# EAGLE schematic Printplaat version 2 with booting problems (EAGLE 9.7.0)

## Sheet 1 of 7: Raspberry Pi CM4 header
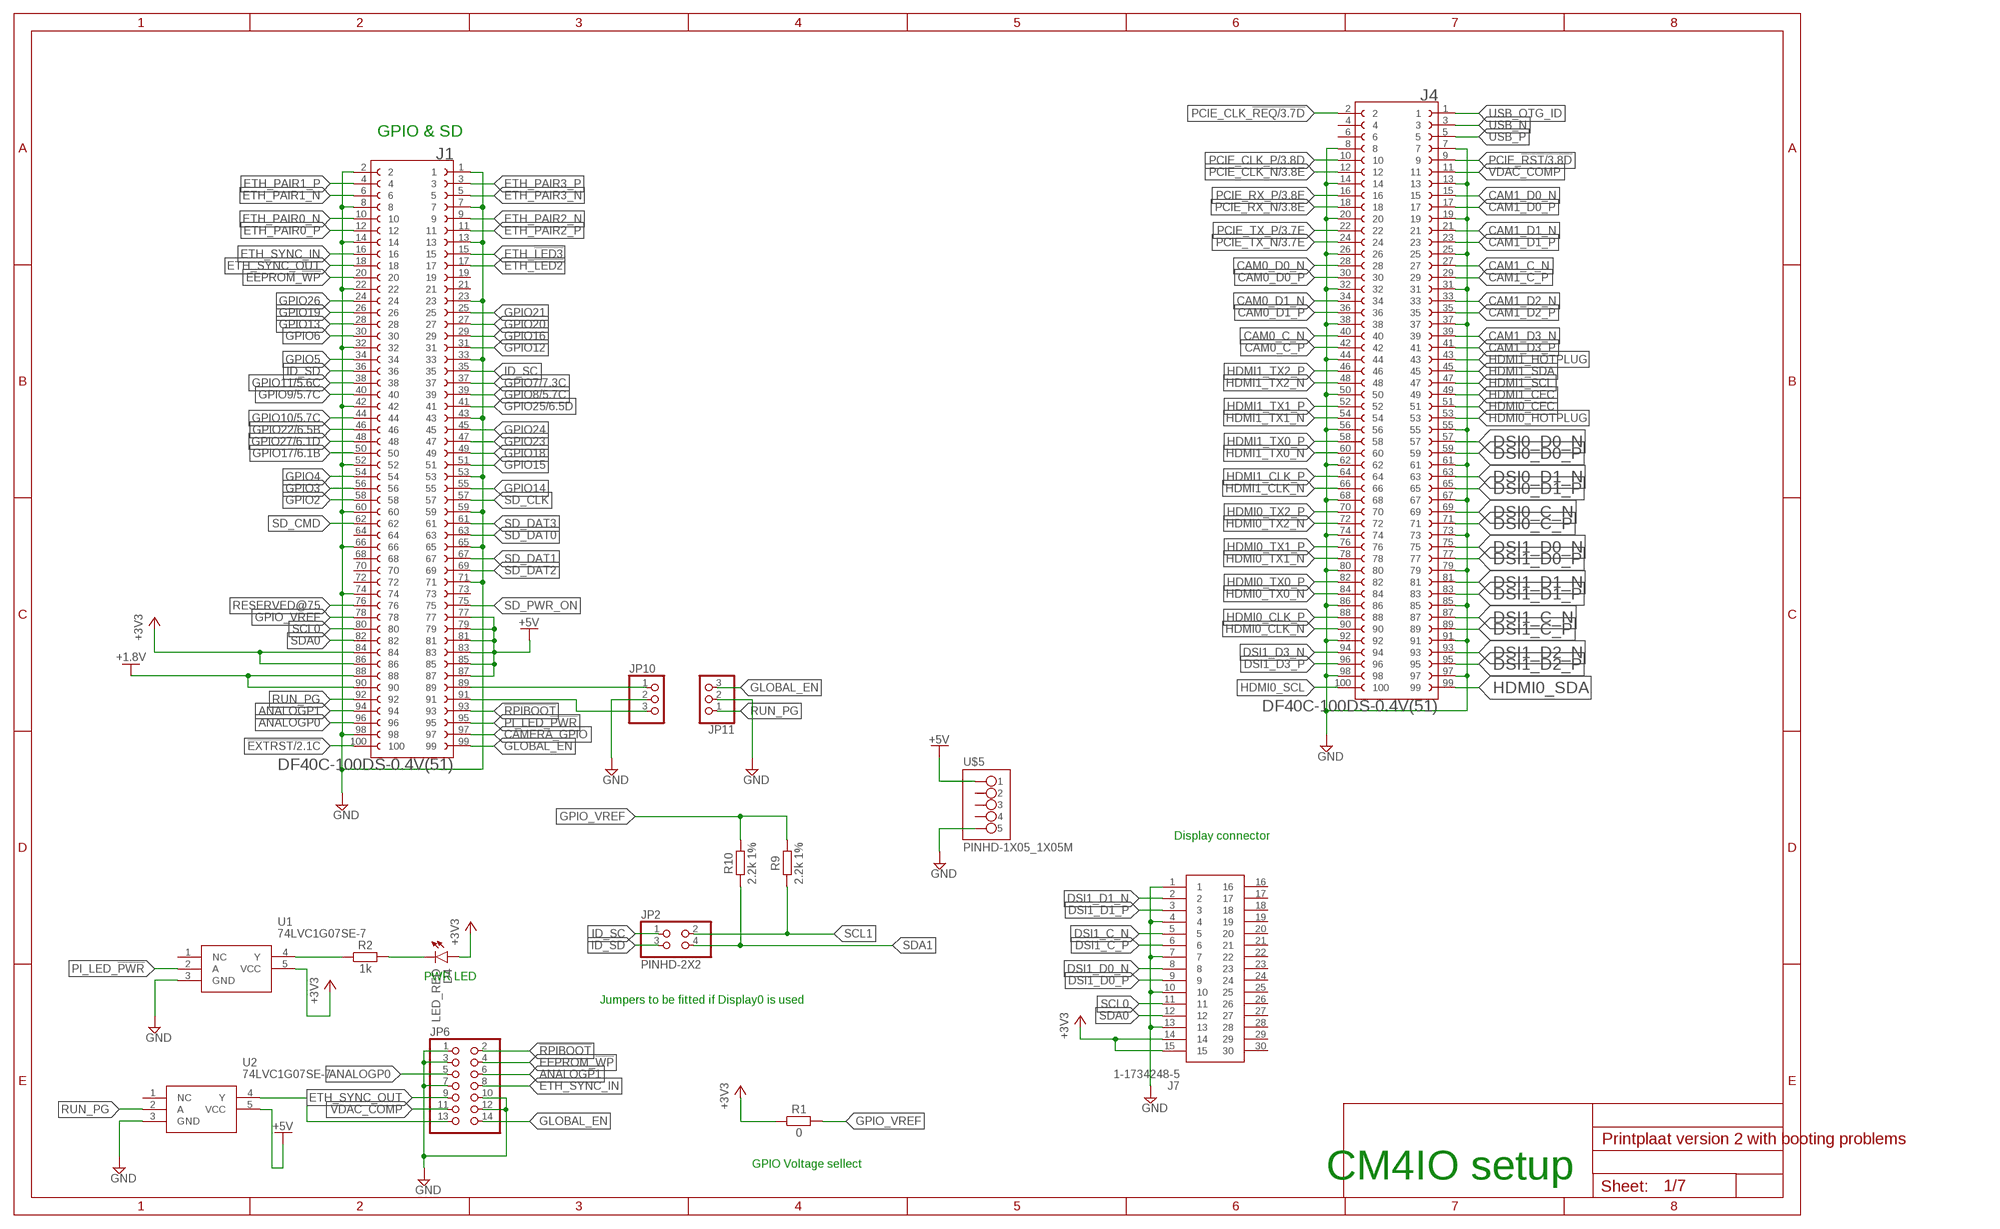
[diagram p0: schematic, sheet 1]

### Parts
D4  LED_RED  CHIP-FLAT-R_1206  [LEDC3216X75N_FLAT-R]
J1  DF40C-100DS-0.4V(51)  [HIROSE_DF40C-100DS-0.4V(51)]
J4  DF40C-100DS-0.4V(51)  [HIROSE_DF40C-100DS-0.4V(51)]
J7  1-1734248-5  [117342485]
JP2  PINHD-2X2  [2X02]
JP6  PINHD-2X7  [2X07]
JP10  PINHD-1X3  [1X03]
JP11  PINHD-1X3  [1X03]
R1  0  RESISTOR__CHIP-1206(3216-METRIC)  [RESC3216X70]
R2  1k  RESISTOR__CHIP-1206(3216-METRIC)  [RESC3216X70]
R9  2.2k 1%  RESISTOR__CHIP-1206(3216-METRIC)  [RESC3216X70]
R10  2.2k 1%  RESISTOR__CHIP-1206(3216-METRIC)  [RESC3216X70]
U1  74LVC1G07SE-7  [SOT65P210X110-5N]
U2  74LVC1G07SE-7  [SOT65P210X110-5N]
U$5  PINHD-1X05_1X05M  [1X05]

### Nets
!EXTRST: J1.100 ; also sheet 2
!RPIBOOT: J1.93 JP6.2
+1.8V: J1.88 J1.90
+3V3: D4.A J1.84 J1.86 J7.14 J7.15 R1.1 U1.5(VCC) ; also sheet 2,3
+5V: J1.77 J1.79 J1.81 J1.83 J1.85 J1.87 U2.5(VCC) U$5.1 ; also sheet 2,3,4,5,6,7
ANALOGP0: J1.96 JP6.5
ANALOGP1: J1.94 JP6.6
CAM0_C_N: J4.40
CAM0_C_P: J4.42
CAM0_D0_N: J4.28
CAM0_D0_P: J4.30
CAM0_D1_N: J4.34
CAM0_D1_P: J4.36
CAM1_C_N: J4.27
CAM1_C_P: J4.29
CAM1_D0_N: J4.15
CAM1_D0_P: J4.17
CAM1_D1_N: J4.21
CAM1_D1_P: J4.23
CAM1_D2_N: J4.33
CAM1_D2_P: J4.35
CAM1_D3_N: J4.39
CAM1_D3_P: J4.41
CAMERA_GPIO: J1.97
DSI0_C_N: J4.69
DSI0_C_P: J4.71
DSI0_D0_N: J4.57
DSI0_D0_P: J4.59
DSI0_D1_N: J4.63
DSI0_D1_P: J4.65
DSI1_C_N: J4.87 J7.5
DSI1_C_P: J4.89 J7.6
DSI1_D0_N: J4.75 J7.8
DSI1_D0_P: J4.77 J7.9
DSI1_D1_N: J4.81 J7.2
DSI1_D1_P: J4.83 J7.3
DSI1_D2_N: J4.93
DSI1_D2_P: J4.95
DSI1_D3_N: J4.94
DSI1_D3_P: J4.96
EEPROM_!WP: J1.20 JP6.4
ETH_!LED2: J1.17
ETH_!LED3: J1.15
ETH_PAIR0_N: J1.10
ETH_PAIR0_P: J1.12
ETH_PAIR1_N: J1.6
ETH_PAIR1_P: J1.4
ETH_PAIR2_N: J1.9
ETH_PAIR2_P: J1.11
ETH_PAIR3_N: J1.5
ETH_PAIR3_P: J1.3
ETH_SYNC_IN: J1.16 JP6.8
ETH_SYNC_OUT: J1.18 JP6.9
GLOBAL_EN: J1.99 JP6.14 JP11.3
GND: J1.1 J1.2 J1.7 J1.8 J1.13 J1.14 J1.22 J1.23 J1.32 J1.33 J1.42 J1.43 J1.52 J1.53 J1.59 J1.60 J1.65 J1.66 J1.71 J1.74 J1.98 J4.7 J4.8 J4.13 J4.14 J4.19 J4.20 J4.25 J4.26 J4.31 J4.32 J4.37 J4.38 J4.44 J4.50 J4.55 J4.56 J4.61 J4.62 J4.67 J4.68 J4.73 J4.74 J4.79 J4.80 J4.85 J4.86 J4.91 J4.92 J4.97 J4.98 J7.1 J7.4 J7.7 J7.10 J7.13 JP6.1 JP6.3 JP6.7 JP6.10 JP6.12 JP10.2 JP11.2 U1.3(GND) U2.3(GND) U$5.5 ; also sheet 2,3,4,5,6,7
GPIO2: J1.58
GPIO3: J1.56
GPIO4: J1.54
GPIO5: J1.34
GPIO6: J1.30
GPIO7: J1.37 ; also sheet 7
GPIO8: J1.39 ; also sheet 5
GPIO9: J1.40 ; also sheet 5
GPIO10: J1.44 ; also sheet 5,7
GPIO11: J1.38 ; also sheet 5,7
GPIO12: J1.31
GPIO13: J1.28
GPIO14: J1.55
GPIO15: J1.51
GPIO16: J1.29
GPIO17: J1.50 ; also sheet 6
GPIO18: J1.49
GPIO19: J1.26
GPIO20: J1.27
GPIO21: J1.25
GPIO22: J1.46 ; also sheet 6
GPIO23: J1.47
GPIO24: J1.45
GPIO25: J1.41 ; also sheet 6
GPIO26: J1.24
GPIO27: J1.48 ; also sheet 6
GPIO_VREF: J1.78 R1.2 R9.2 R10.2
HDMI0_CEC: J4.51
HDMI0_CLK_N: J4.90
HDMI0_CLK_P: J4.88
HDMI0_HOTPLUG: J4.53
HDMI0_SCL: J4.100
HDMI0_SDA: J4.99
HDMI0_TX0_N: J4.84
HDMI0_TX0_P: J4.82
HDMI0_TX1_N: J4.78
HDMI0_TX1_P: J4.76
HDMI0_TX2_N: J4.72
HDMI0_TX2_P: J4.70
HDMI1_CEC: J4.49
HDMI1_CLK_N: J4.66
HDMI1_CLK_P: J4.64
HDMI1_HOTPLUG: J4.43
HDMI1_SCL: J4.47
HDMI1_SDA: J4.45
HDMI1_TX0_N: J4.60
HDMI1_TX0_P: J4.58
HDMI1_TX1_N: J4.54
HDMI1_TX1_P: J4.52
HDMI1_TX2_N: J4.48
HDMI1_TX2_P: J4.46
ID_SC: J1.35 JP2.1
ID_SD: J1.36 JP2.3
N$3: R2.1 U1.4(Y)
N$4: D4.C R2.2
N$5: JP6.13 U2.4(Y)
N$54: J1.89 JP10.1
N$55: J1.91 JP10.3
PCIE_!RST: J4.9 ; also sheet 3
PCIE_CLK_!REQ: J4.2 ; also sheet 3
PCIE_CLK_N: J4.12 ; also sheet 3
PCIE_CLK_P: J4.10 ; also sheet 3
PCIE_RX_N: J4.18 ; also sheet 3
PCIE_RX_P: J4.16 ; also sheet 3
PCIE_TX_N: J4.24 ; also sheet 3
PCIE_TX_P: J4.22 ; also sheet 3
PI_LED_!PWR: J1.95 U1.2(A)
RESERVED@75: J1.76
RUN_PG: J1.92 JP11.1 U2.2(A)
SCL0: J1.80 J7.11
SCL1: JP2.2 R9.1
SD_CLK: J1.57
SD_CMD: J1.62
SD_DAT0: J1.63
SD_DAT1: J1.67
SD_DAT2: J1.69
SD_DAT3: J1.61
SD_PWR_ON: J1.75
SDA0: J1.82 J7.12
SDA1: JP2.4 R10.1
USB_N: J4.3
USB_OTG_ID: J4.1
USB_P: J4.5
VDAC_COMP: J4.11 JP6.11
Unconnected: J1.19 J1.21 J1.64 J1.68 J1.70 J1.72 J1.73 J4.4 J4.6 J7.16 J7.17 J7.18 J7.19 J7.20 J7.21 J7.22 J7.23 J7.24 J7.25 J7.26 J7.27 J7.28 J7.29 J7.30 U1.1(NC) U2.1(NC) U$5.2 U$5.3 U$5.4

### Notes on the sheet
- GPIO & SD
- Display connector
- PWR LED
- Jumpers to be fitted if Display0 is used
- GPIO Voltage sellect
- CM4IO setup

## Sheet 2 of 7: USB & ESD protection
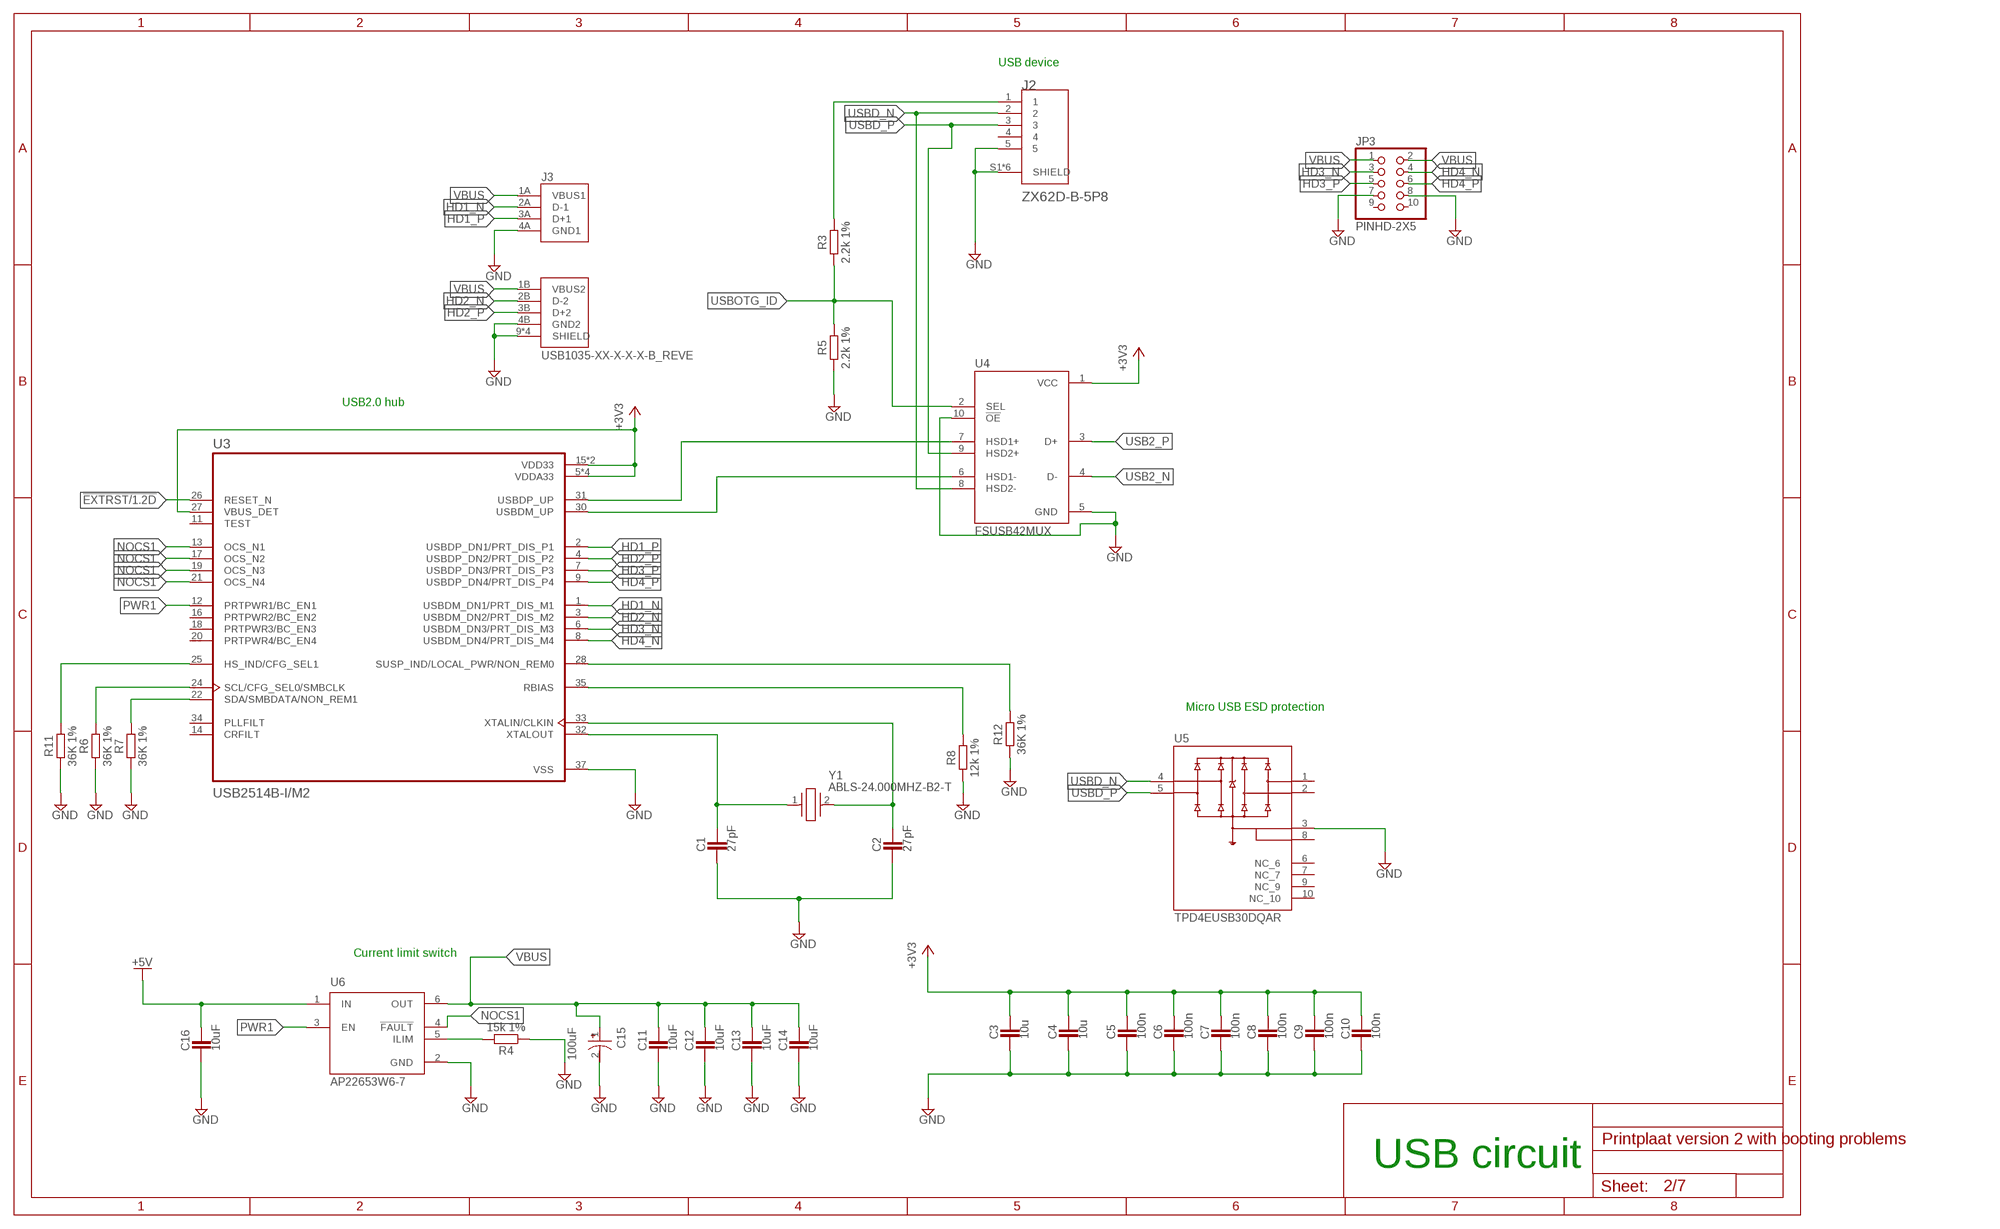
[diagram p1: schematic, sheet 2]

### Parts
C1  27pF  CAPACITOR_CHIP-1206(3216-METRIC)  [CAPC3216X135]
C2  27pF  CAPACITOR_CHIP-1206(3216-METRIC)  [CAPC3216X135]
C3  10u  CAPACITOR_CHIP-1206(3216-METRIC)  [CAPC3216X135]
C4  10u  CAPACITOR_CHIP-1206(3216-METRIC)  [CAPC3216X135]
C5  100n  CAPACITOR_CHIP-1206(3216-METRIC)  [CAPC3216X135]
C6  100n  CAPACITOR_CHIP-1206(3216-METRIC)  [CAPC3216X135]
C7  100n  CAPACITOR_CHIP-1206(3216-METRIC)  [CAPC3216X135]
C8  100n  CAPACITOR_CHIP-1206(3216-METRIC)  [CAPC3216X135]
C9  100n  CAPACITOR_CHIP-1206(3216-METRIC)  [CAPC3216X135]
C10  100n  CAPACITOR_CHIP-1206(3216-METRIC)  [CAPC3216X135]
C11  10uF  CAPACITOR_CHIP-1206(3216-METRIC)  [CAPC3216X135]
C12  10uF  CAPACITOR_CHIP-1206(3216-METRIC)  [CAPC3216X135]
C13  10uF  CAPACITOR_CHIP-1206(3216-METRIC)  [CAPC3216X135]
C14  10uF  CAPACITOR_CHIP-1206(3216-METRIC)  [CAPC3216X135]
C15  100uF  20TDC100MYF  [CAP_20TDC100MYF]
C16  10uF  CAPACITOR_CHIP-1206(3216-METRIC)  [CAPC3216X135]
J2  ZX62D-B-5P8  [HRS_ZX62D-B-5P8]
J3  USB1035-XX-X-X-X-B_REVE  [GCT_USB1035-XX-X-X-X-B_REVE]
JP3  PINHD-2X5  [2X05]
R3  2.2k 1%  RESISTOR__CHIP-1206(3216-METRIC)  [RESC3216X70]
R4  15k 1%  RESISTOR__CHIP-1206(3216-METRIC)  [RESC3216X70]
R5  2.2k 1%  RESISTOR__CHIP-1206(3216-METRIC)  [RESC3216X70]
R6  36K 1%  RESISTOR__CHIP-1206(3216-METRIC)  [RESC3216X70]
R7  36K 1%  RESISTOR__CHIP-1206(3216-METRIC)  [RESC3216X70]
R8  12k 1%  RESISTOR__CHIP-1206(3216-METRIC)  [RESC3216X70]
R11  36K 1%  RESISTOR__CHIP-1206(3216-METRIC)  [RESC3216X70]
R12  36K 1%  RESISTOR__CHIP-1206(3216-METRIC)  [RESC3216X70]
U3  USB2514B-I/M2  [QFN50P600X600X100-37N]
U4  FSUSB42MUX  [SOP50P490X110-10N]
U5  TPD4EUSB30DQAR  [IC_TPD4EUSB30DQAR]
U6  AP22653W6-7  [SOT95P280X145-6N]
Y1  ABLS-24.000MHZ-B2-T  [ABLS]

### Nets
!EXTRST: U3.26(RESET_N) ; also sheet 1
+3V3: C3.1 C4.1 C5.1 C6.1 C7.1 C8.1 C9.1 C10.1 U3.5(VDDA33) U3.10(VDDA33) U3.15(VDD33) U3.23(VDD33) U3.27(VBUS_DET) U3.29(VDDA33) U3.36(VDDA33) U4.1(VCC) ; also sheet 1,3
+5V: C16.1 U6.1(IN) ; also sheet 1,3,4,5,6,7
GND: C1.2 C2.2 C3.2 C4.2 C5.2 C6.2 C7.2 C8.2 C9.2 C10.2 C11.2 C12.2 C13.2 C14.2 C15.2 C16.2 J2.5 J2.S1(SHIELD) J2.S2(SHIELD) J2.S3(SHIELD) J2.S4(SHIELD) J2.S5(SHIELD) J2.S6(SHIELD) J3.4A(GND1) J3.4B(GND2) J3.9(SHIELD) J3.10(SHIELD) J3.11(SHIELD) J3.12(SHIELD) JP3.7 JP3.8 R4.1 R5.1 R6.1 R7.1 R8.1 R11.1 R12.1 U3.37(VSS) U4.5(GND) U4.10(!OE) U5.3(GND_3) U6.2(GND) ; also sheet 1,3,4,5,6,7
HD1_N: J3.2A(D-1) U3.1(USBDM_DN1/PRT_DIS_M1)
HD1_P: J3.3A(D+1) U3.2(USBDP_DN1/PRT_DIS_P1)
HD2_N: J3.2B(D-2) U3.3(USBDM_DN2/PRT_DIS_M2)
HD2_P: J3.3B(D+2) U3.4(USBDP_DN2/PRT_DIS_P2)
HD3_N: JP3.3 U3.6(USBDM_DN3/PRT_DIS_M3)
HD3_P: JP3.5 U3.7(USBDP_DN3/PRT_DIS_P3)
HD4_N: JP3.4 U3.8(USBDM_DN4/PRT_DIS_M4)
HD4_P: JP3.6 U3.9(USBDP_DN4/PRT_DIS_P4)
N$6: R7.2 U3.22(SDA/SMBDATA/NON_REM1)
N$7: R6.2 U3.24(SCL/CFG_SEL0/SMBCLK)
N$8: R11.2 U3.25(HS_IND/CFG_SEL1)
N$9: R12.2 U3.28(SUSP_IND/LOCAL_PWR/NON_REM0)
N$10: R8.2 U3.35(RBIAS)
N$11: C2.1 U3.33(XTALIN/CLKIN) Y1.2
N$12: C1.1 U3.32(XTALOUT) Y1.1
N$13: U3.31(USBDP_UP) U4.7(HSD1+)
N$14: U3.30(USBDM_UP) U4.6(HSD1-)
N$17: J2.1 R3.2
N$18: R4.2 U6.5(ILIM)
NOCS1: U3.13(OCS_N1) U3.17(OCS_N2) U3.19(OCS_N3) U3.21(OCS_N4) U6.4(!FAULT)
PWR1: U3.12(PRTPWR1/BC_EN1) U6.3(EN)
USB2_N: U4.4(D-)
USB2_P: U4.3(D+)
USBD_N: J2.2 U4.8(HSD2-) U5.4(D2+)
USBD_P: J2.3 U4.9(HSD2+) U5.5(D2-)
USBOTG_ID: R3.1 R5.2 U4.2(SEL)
VBUS: C11.1 C12.1 C13.1 C14.1 C15.1 J3.1A(VBUS1) J3.1B(VBUS2) JP3.1 JP3.2 U6.6(OUT)
Unconnected: J2.4 JP3.9 JP3.10 U3.11(TEST) U3.14(CRFILT) U3.16(PRTPWR2/BC_EN2) U3.18(PRTPWR3/BC_EN3) U3.20(PRTPWR4/BC_EN4) U3.34(PLLFILT) U5.1(D1+) U5.2(D1-) U5.6(NC_6) U5.7(NC_7) U5.9(NC_9) U5.10(NC_10)

### Notes on the sheet
- USB device
- USB2.0 hub
- Micro USB ESD protection
- Current limit switch
- USB circuit

## Sheet 3 of 7: PCIe connector and 12V Boost Converter
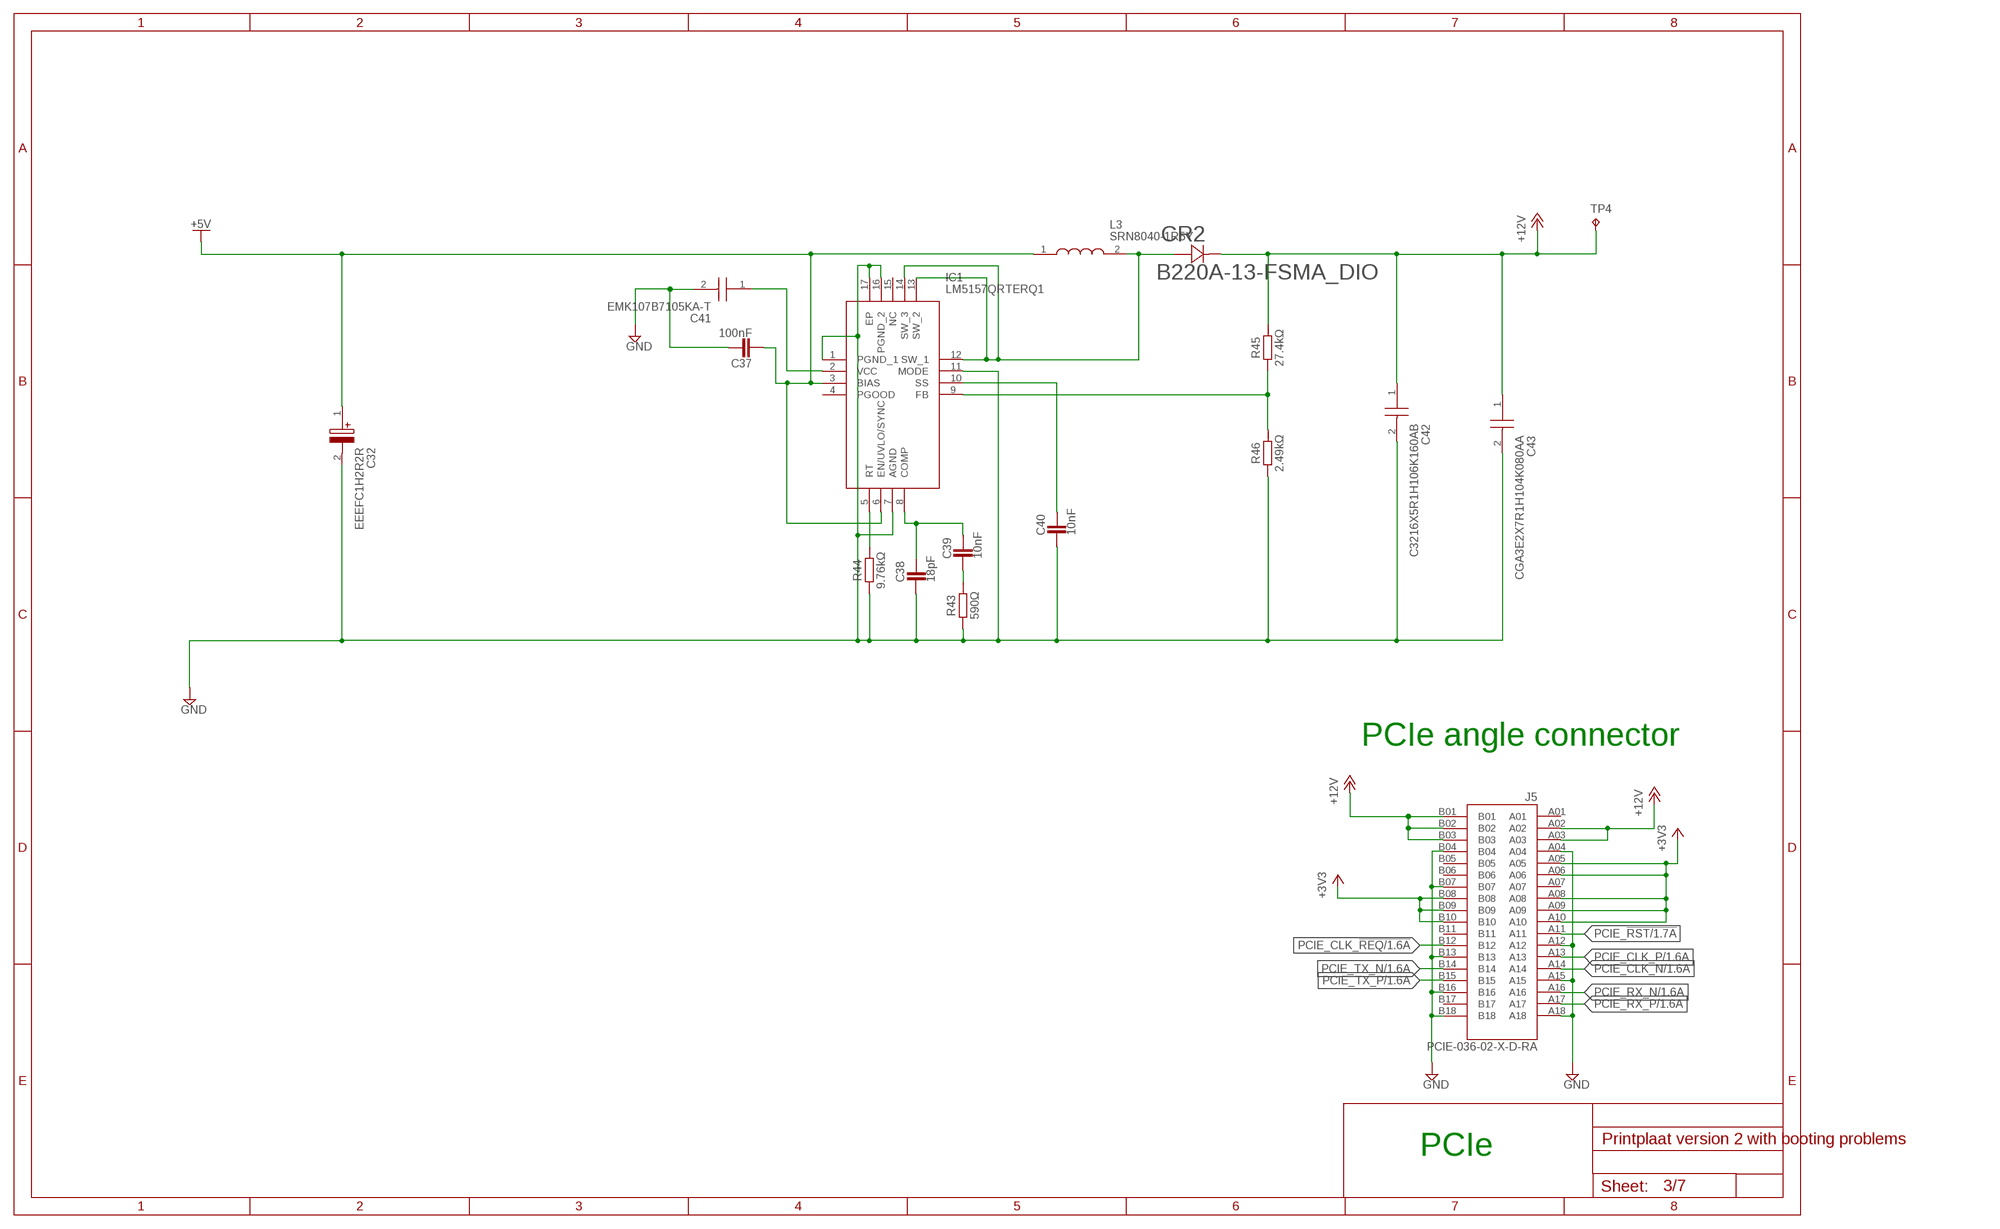
[diagram p2: schematic, sheet 3]

### Parts
C32  EEEFC1H2R2R  [EEE1AA220WR]
C37  100nF  CAPACITOR_CHIP-1206(3216-METRIC)  [CAPC3216X135]
C38  18pF  CAPACITOR_CHIP-1206(3216-METRIC)  [CAPC3216X135]
C39  10nF  CAPACITOR_CHIP-1206(3216-METRIC)  [CAPC3216X135]
C40  10nF  CAPACITOR_CHIP-1206(3216-METRIC)  [CAPC3216X135]
C41  EMK107B7105KA-T  [CAPC1608X90N]
C42  C3216X5R1H106K160AB  [CAPC3216X180N]
C43  CGA3E2X7R1H104K080AA  [CAPC1608X90N]
CR2  B220A-13-FSMA_DIO  [SMA_DIO]
IC1  LM5157QRTERQ1  [QFN50P300X300X80-17N]
J5  PCIE-036-02-X-D-RA  [SAMTEC_PCIE-036-02-X-D-RA]
L3  SRN8040-1R5Y  [SRN80408R2Y]
R43  590Ω  RESISTOR__CHIP-1206(3216-METRIC)  [RESC3216X70]
R44  9.76kΩ  RESISTOR__CHIP-1206(3216-METRIC)  [RESC3216X70]
R45  27.4kΩ  RESISTOR__CHIP-1206(3216-METRIC)  [RESC3216X70]
R46  2.49kΩ  RESISTOR__CHIP-1206(3216-METRIC)  [RESC3216X70]
TP4  TPB1,27  [B1,27]

### Nets
+3V3: J5.A05 J5.A06 J5.A08 J5.A09 J5.A10 J5.B08 J5.B09 J5.B10 ; also sheet 1,2
+5V: C32.1(+) C37.2 IC1.3(BIAS) IC1.6(EN/UVLO/SYNC) L3.1 ; also sheet 1,2,4,5,6,7
+12V: C42.1 C43.1 CR2.1 J5.A02 J5.A03 J5.B01 J5.B02 J5.B03 R45.2 TP4.TP
GND: C32.2(-) C37.1 C38.2 C40.2 C41.2 C42.2 C43.2 IC1.1(PGND_1) IC1.7(AGND) IC1.11(MODE) IC1.16(PGND_2) IC1.17(EP) J5.A04 J5.A12 J5.A15 J5.A18 J5.B04 J5.B07 J5.B13 J5.B16 J5.B18 R43.1 R44.1 R46.1 ; also sheet 1,2,4,5,6,7
N$57: C41.1 IC1.2(VCC)
N$58: C38.1 C39.1 IC1.8(COMP)
N$59: C39.2 R43.2
N$60: C40.1 IC1.10(SS)
N$61: IC1.5(RT) R44.2
N$62: CR2.2 IC1.12(SW_1) IC1.13(SW_2) IC1.14(SW_3) L3.2
N$63: IC1.9(FB) R45.1 R46.2
PCIE_!RST: J5.A11 ; also sheet 1
PCIE_CLK_!REQ: J5.B12 ; also sheet 1
PCIE_CLK_N: J5.A14 ; also sheet 1
PCIE_CLK_P: J5.A13 ; also sheet 1
PCIE_RX_N: J5.A16 ; also sheet 1
PCIE_RX_P: J5.A17 ; also sheet 1
PCIE_TX_N: J5.B14 ; also sheet 1
PCIE_TX_P: J5.B15 ; also sheet 1
Unconnected: IC1.4(PGOOD) IC1.15(NC) J5.A01 J5.A07 J5.B05 J5.B06 J5.B11 J5.B17

### Notes on the sheet
- PCIe angle connector
- PCIe

## Sheet 4 of 7: Buck & Boost converter
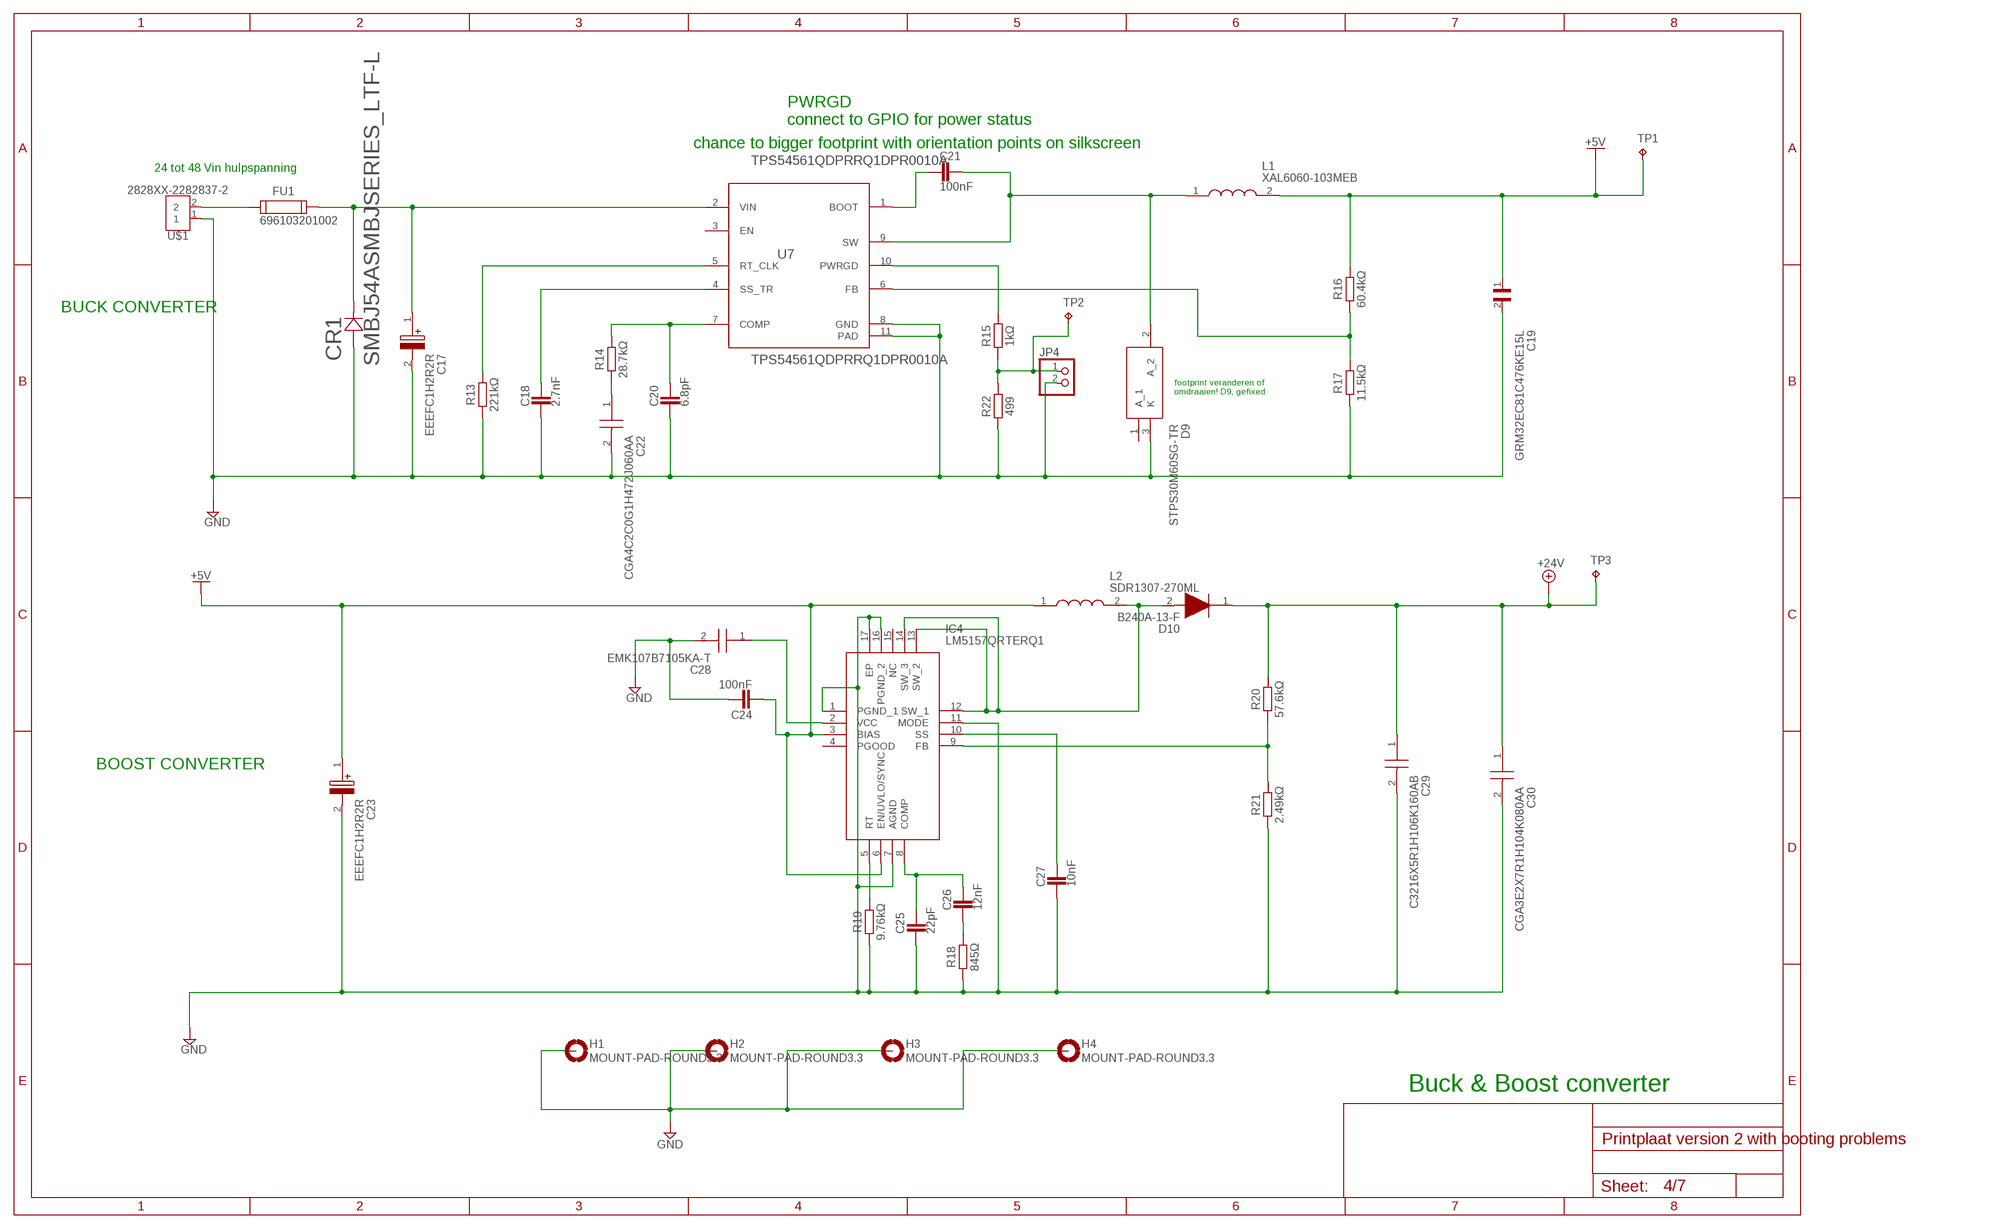
[diagram p3: schematic, sheet 4]

### Parts
C17  EEEFC1H2R2R  [EEE1AA220WR]
C18  2.7nF  CAPACITOR_CHIP-1206(3216-METRIC)  [CAPC3216X135]
C19  GRM32EC81C476KE15L  [CAPC3225X270N]
C20  6.8pF  CAPACITOR_CHIP-1206(3216-METRIC)  [CAPC3216X135]
C21  100nF  CAPACITOR_CHIP-1206(3216-METRIC)  [CAPC3216X135]
C22  CGA4C2C0G1H472J060AA  [CAPC2012X75N]
C23  EEEFC1H2R2R  [EEE1AA220WR]
C24  100nF  CAPACITOR_CHIP-1206(3216-METRIC)  [CAPC3216X135]
C25  22pF  CAPACITOR_CHIP-1206(3216-METRIC)  [CAPC3216X135]
C26  12nF  CAPACITOR_CHIP-1206(3216-METRIC)  [CAPC3216X135]
C27  10nF  CAPACITOR_CHIP-1206(3216-METRIC)  [CAPC3216X135]
C28  EMK107B7105KA-T  [CAPC1608X90N]
C29  C3216X5R1H106K160AB  [CAPC3216X180N]
C30  CGA3E2X7R1H104K080AA  [CAPC1608X90N]
CR1  SMBJ54ASMBJSERIES_LTF-L  [SMBJSERIES_LTF-L]
D9  STPS30M60SG-TR  [T1210T8G]
D10  B240A-13-F  [DIOM5226X230N]
FU1  696103201002  [696103201002]
H1  MOUNT-PAD-ROUND3.3  [3,3-PAD]
H2  MOUNT-PAD-ROUND3.3  [3,3-PAD]
H3  MOUNT-PAD-ROUND3.3  [3,3-PAD]
H4  MOUNT-PAD-ROUND3.3  [3,3-PAD]
IC4  LM5157QRTERQ1  [QFN50P300X300X80-17N]
JP4  PINHD-1X2  [1X02]
L1  XAL6060-103MEB  [XAL6060-103MEB]
L2  SDR1307-270ML  [SDR1307270ML]
R13  221kΩ  RESISTOR__CHIP-1206(3216-METRIC)  [RESC3216X70]
R14  28.7kΩ  RESISTOR__CHIP-1206(3216-METRIC)  [RESC3216X70]
R15  1kΩ  RESISTOR__CHIP-1206(3216-METRIC)  [RESC3216X70]
R16  60.4kΩ  RESISTOR__CHIP-1206(3216-METRIC)  [RESC3216X70]
R17  11.5kΩ  RESISTOR__CHIP-1206(3216-METRIC)  [RESC3216X70]
R18  845Ω  RESISTOR__CHIP-1206(3216-METRIC)  [RESC3216X70]
R19  9.76kΩ  RESISTOR__CHIP-1206(3216-METRIC)  [RESC3216X70]
R20  57.6kΩ  RESISTOR__CHIP-1206(3216-METRIC)  [RESC3216X70]
R21  2.49kΩ  RESISTOR__CHIP-1206(3216-METRIC)  [RESC3216X70]
R22  499  RESISTOR__CHIP-1206(3216-METRIC)  [RESC3216X70]
TP1  TPB1,27  [B1,27]
TP2  TPB1,27  [B1,27]
TP3  TPB1,27  [B1,27]
U7  TPS54561QDPRRQ1DPR0010A  [DPR0010A]
U$1  2828XX-2282837-2  [TERMBLK_508-2N]

### Nets
+5V: C19.1 C23.1(+) C24.2 IC4.3(BIAS) IC4.6(EN/UVLO/SYNC) L1.2 L2.1 R16.2 TP1.TP ; also sheet 1,2,3,5,6,7
+24V: C29.1 C30.1 D10.1(K) R20.2 TP3.TP ; also sheet 5,6,7
GND: C17.2(-) C18.2 C19.2 C20.2 C22.2 C23.2(-) C24.1 C25.2 C27.2 C28.2 C29.2 C30.2 CR1.2 D9.3(K) H1.B3,3(MOUNT) H2.B3,3(MOUNT) H3.B3,3(MOUNT) H4.B3,3(MOUNT) IC4.1(PGND_1) IC4.7(AGND) IC4.11(MODE) IC4.16(PGND_2) IC4.17(EP) JP4.2 R13.1 R17.1 R18.1 R19.1 R21.1 R22.1 U7.8(GND) U7.11(PAD) U$1.1 ; also sheet 1,2,3,5,6,7
N$22: C17.1(+) CR1.1 FU1.2 U7.2(VIN)
N$23: R13.2 U7.5(RT_CLK)
N$24: C18.1 U7.4(SS_TR)
N$25: C22.1 R14.1
N$26: C20.1 R14.2 U7.7(COMP)
N$27: C21.2 U7.1(BOOT)
N$28: C21.1 D9.2(A_2) L1.1 U7.9(SW)
N$29: R15.2 U7.10(PWRGD)
N$30: R16.1 R17.2 U7.6(FB)
N$31: C28.1 IC4.2(VCC)
N$32: C25.1 C26.1 IC4.8(COMP)
N$33: C26.2 R18.2
N$34: C27.1 IC4.10(SS)
N$35: IC4.5(RT) R19.2
N$36: D10.2(A) IC4.12(SW_1) IC4.13(SW_2) IC4.14(SW_3) L2.2
N$37: IC4.9(FB) R20.1 R21.2
N$38: JP4.1 R15.1 R22.2 TP2.TP
N$53: FU1.1 U$1.2
Unconnected: D9.1(A_1) IC4.4(PGOOD) IC4.15(NC) U7.3(EN)

### Notes on the sheet
- PWRGD 
  connect to GPIO for power status
- chance to bigger footprint with orientation points on silkscreen
- 24 tot 48 Vin hulpspanning
- BUCK CONVERTER
- footprint veranderen of
  omdraaien! D9, gefixed
- BOOST CONVERTER
- Buck & Boost converter

## Sheet 5 of 7: Current sensor and ADC
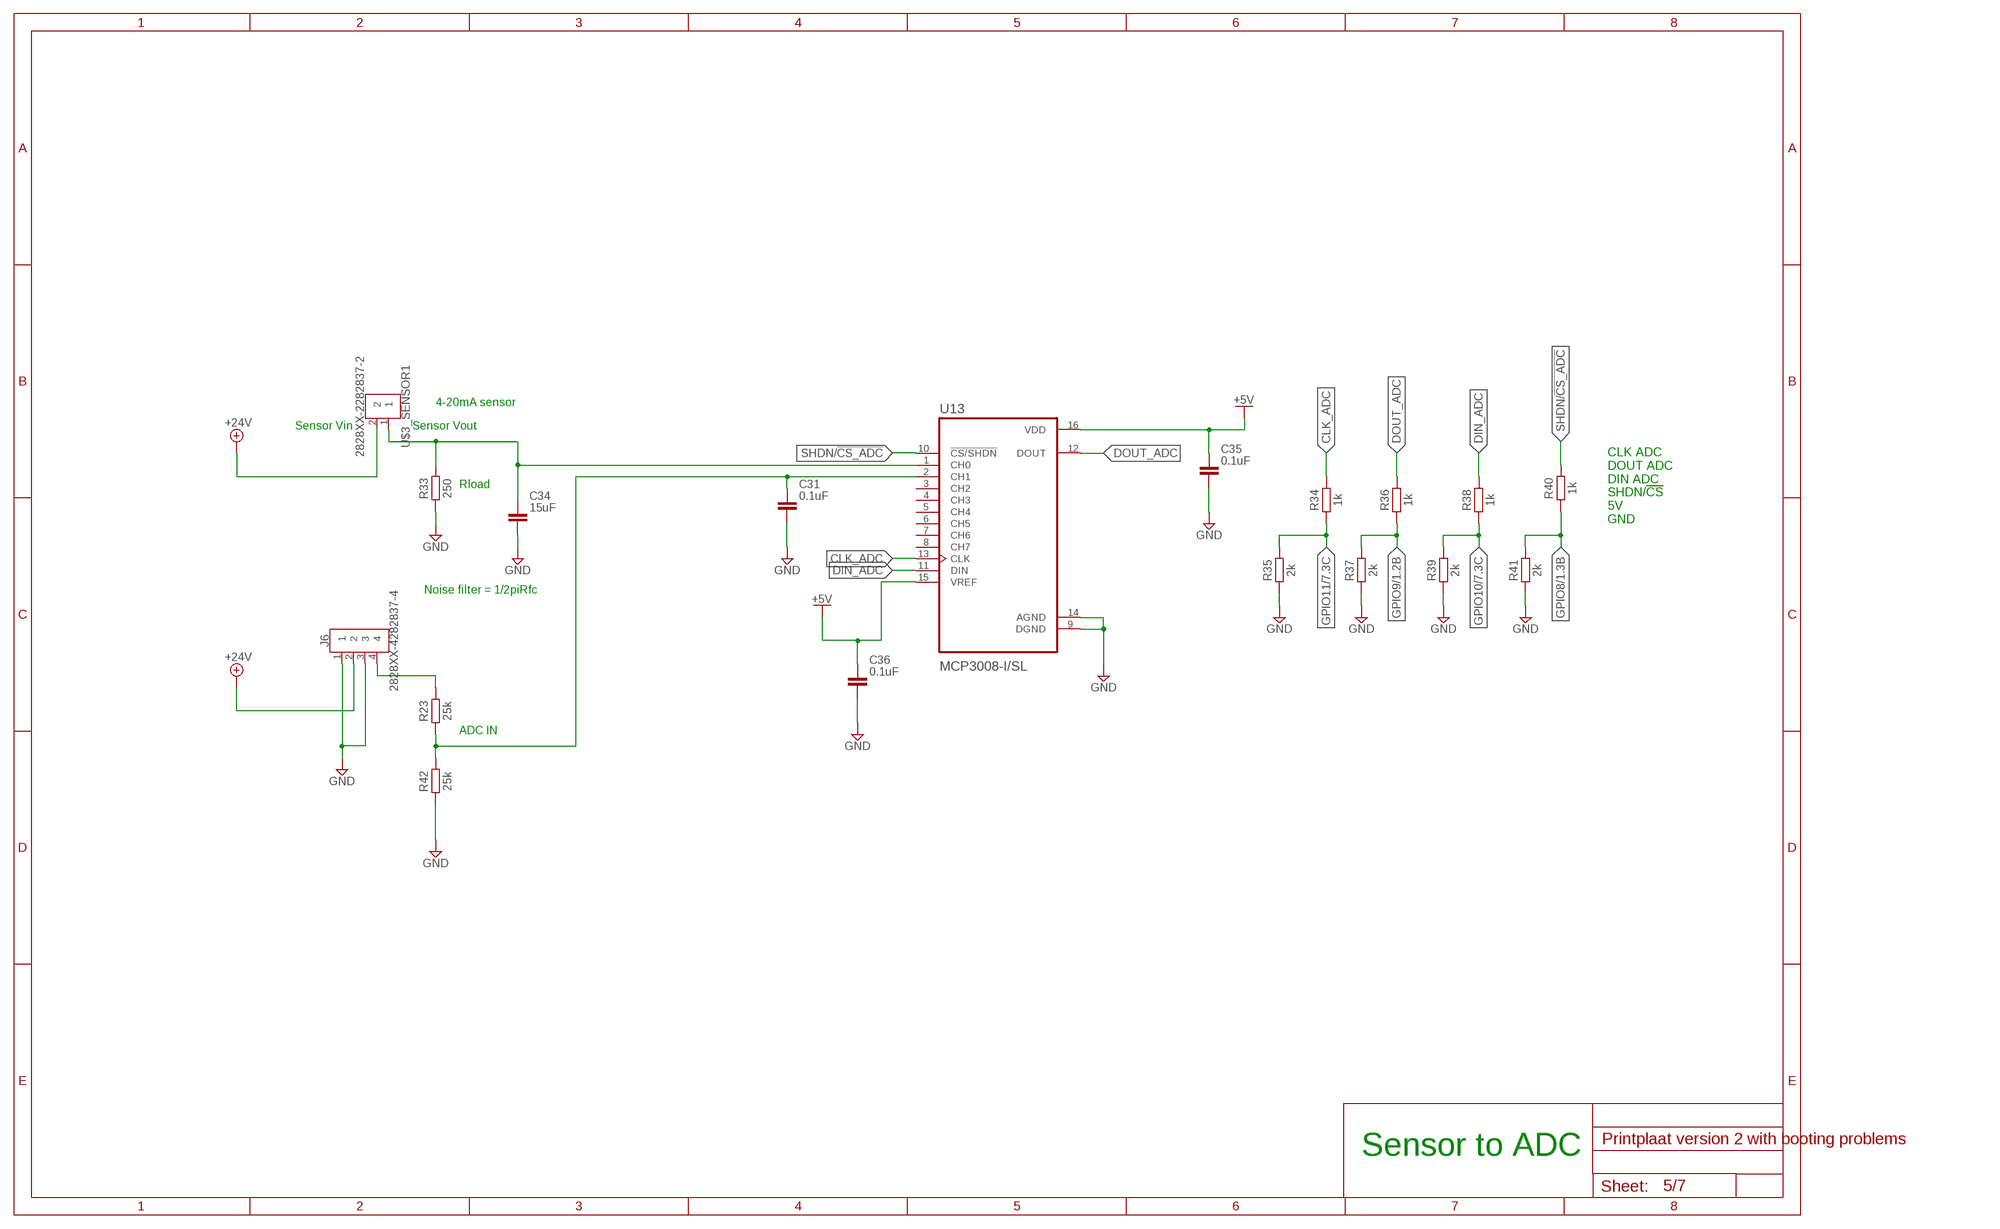
[diagram p4: schematic, sheet 5]

### Parts
C31  0.1uF  C_CHIP-1206(3216-METRIC)  [CAPC3216X135]
C34  15uF  C_CHIP-1206(3216-METRIC)  [CAPC3216X135]
C35  0.1uF  C_CHIP-1206(3216-METRIC)  [CAPC3216X135]
C36  0.1uF  C_CHIP-1206(3216-METRIC)  [CAPC3216X135]
J6  2828XX-4282837-4  [TERMBLK_508-4N]
R23  25k  RESISTOR__CHIP-1206(3216-METRIC)  [RESC3216X70]
R33  250  RESISTOR__CHIP-1206(3216-METRIC)  [RESC3216X70]
R34  1k  RESISTOR__CHIP-1206(3216-METRIC)  [RESC3216X70]
R35  2k  RESISTOR__CHIP-1206(3216-METRIC)  [RESC3216X70]
R36  1k  RESISTOR__CHIP-1206(3216-METRIC)  [RESC3216X70]
R37  2k  RESISTOR__CHIP-1206(3216-METRIC)  [RESC3216X70]
R38  1k  RESISTOR__CHIP-1206(3216-METRIC)  [RESC3216X70]
R39  2k  RESISTOR__CHIP-1206(3216-METRIC)  [RESC3216X70]
R40  1k  RESISTOR__CHIP-1206(3216-METRIC)  [RESC3216X70]
R41  2k  RESISTOR__CHIP-1206(3216-METRIC)  [RESC3216X70]
R42  25k  RESISTOR__CHIP-1206(3216-METRIC)  [RESC3216X70]
U13  MCP3008-I/SL  [SOIC127P600X175-16N]
U$3_SENSOR1  2828XX-2282837-2  [TERMBLK_508-2N]

### Nets
+5V: C35.1 C36.1 U13.15(VREF) U13.16(VDD) ; also sheet 1,2,3,4,6,7
+24V: J6.2 U$3_SENSOR1.2 ; also sheet 4,6,7
CLK_ADC: R34.2 U13.13(CLK)
DIN_ADC: R38.2 U13.11(DIN)
DOUT_ADC: R36.2 U13.12(DOUT)
GND: C31.2 C34.2 C35.2 C36.2 J6.1 J6.3 R33.1 R35.1 R37.1 R39.1 R41.1 R42.1 U13.9(DGND) U13.14(AGND) ; also sheet 1,2,3,4,6,7
GPIO8: R40.1 R41.2 ; also sheet 1
GPIO9: R36.1 R37.2 ; also sheet 1
GPIO10: R38.1 R39.2 ; also sheet 1,7
GPIO11: R34.1 R35.2 ; also sheet 1,7
N$1: J6.4 R23.2
N$20: C34.1 R33.2 U13.1(CH0) U$3_SENSOR1.1
N$56: C31.1 R23.1 R42.2 U13.2(CH1)
SHDN/!CS_ADC: R40.2 U13.10(!CS/SHDN)
Unconnected: U13.3(CH2) U13.4(CH3) U13.5(CH4) U13.6(CH5) U13.7(CH6) U13.8(CH7)

### Notes on the sheet
- 4-20mA sensor
- Sensor Vin | Sensor Vout
- Rload
- CLK ADC
  DOUT ADC
  DIN ADC
  SHDN/!CS
  5V
  GND
- Noise filter = 1/2piRfc
- ADC IN
- Sensor to ADC

## Sheet 6 of 7: SCADA & BMS alarm relays
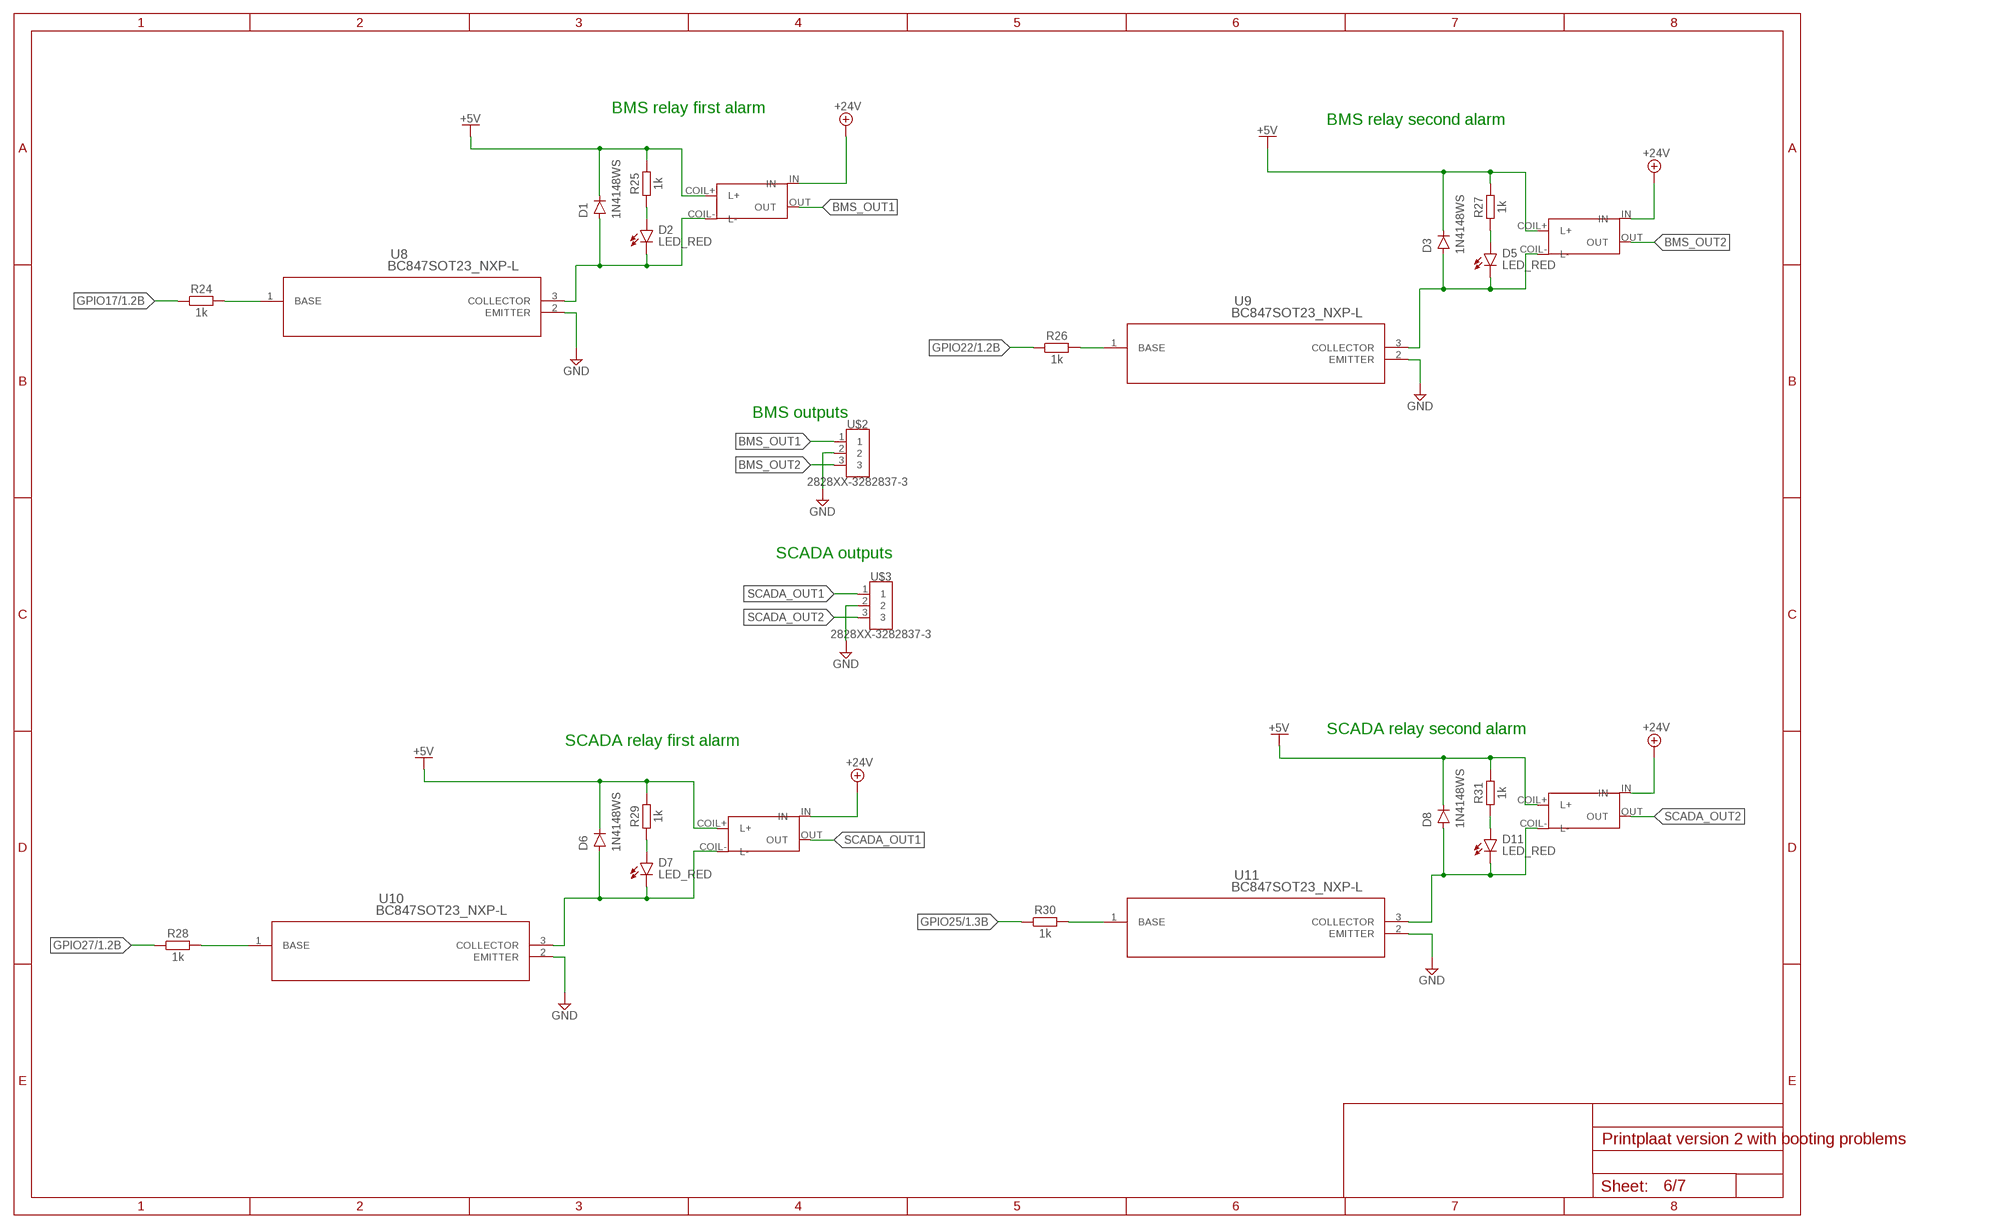
[diagram p5: schematic, sheet 6]

### Parts
D1  1N4148WS  [SOD-323]
D2  LED_RED  CHIP-FLAT-R_1206  [LEDC3216X75N_FLAT-R]
D3  1N4148WS  [SOD-323]
D5  LED_RED  CHIP-FLAT-R_1206  [LEDC3216X75N_FLAT-R]
D6  1N4148WS  [SOD-323]
D7  LED_RED  CHIP-FLAT-R_1206  [LEDC3216X75N_FLAT-R]
D8  1N4148WS  [SOD-323]
D11  LED_RED  CHIP-FLAT-R_1206  [LEDC3216X75N_FLAT-R]
R24  1k  RESISTOR__CHIP-1206(3216-METRIC)  [RESC3216X70]
R25  1k  RESISTOR__CHIP-1206(3216-METRIC)  [RESC3216X70]
R26  1k  RESISTOR__CHIP-1206(3216-METRIC)  [RESC3216X70]
R27  1k  RESISTOR__CHIP-1206(3216-METRIC)  [RESC3216X70]
R28  1k  RESISTOR__CHIP-1206(3216-METRIC)  [RESC3216X70]
R29  1k  RESISTOR__CHIP-1206(3216-METRIC)  [RESC3216X70]
R30  1k  RESISTOR__CHIP-1206(3216-METRIC)  [RESC3216X70]
R31  1k  RESISTOR__CHIP-1206(3216-METRIC)  [RESC3216X70]
RELAY1  ZETTLER_5V_RELAY  [ZETTLER_5V_RELAY]
RELAY2  ZETTLER_5V_RELAY  [ZETTLER_5V_RELAY]
RELAY3  ZETTLER_5V_RELAY  [ZETTLER_5V_RELAY]
RELAY4  ZETTLER_5V_RELAY  [ZETTLER_5V_RELAY]
U8  BC847SOT23_NXP-L  [SOT23_NXP-L]
U9  BC847SOT23_NXP-L  [SOT23_NXP-L]
U10  BC847SOT23_NXP-L  [SOT23_NXP-L]
U11  BC847SOT23_NXP-L  [SOT23_NXP-L]
U$2  2828XX-3282837-3  [TERMBLK_508-3N]
U$3  2828XX-3282837-3  [TERMBLK_508-3N]

### Nets
+5V: D1.C D3.C D6.C D8.C R25.2 R27.2 R29.2 R31.2 RELAY1.COIL+(L+) RELAY2.COIL+(L+) RELAY3.COIL+(L+) RELAY4.COIL+(L+) ; also sheet 1,2,3,4,5,7
+24V: RELAY1.IN RELAY2.IN RELAY3.IN RELAY4.IN ; also sheet 4,5,7
BMS_OUT1: RELAY1.OUT U$2.1
BMS_OUT2: RELAY2.OUT U$2.3
GND: U8.2(EMITTER) U9.2(EMITTER) U10.2(EMITTER) U11.2(EMITTER) U$2.2 U$3.2 ; also sheet 1,2,3,4,5,7
GPIO17: R24.1 ; also sheet 1
GPIO22: R26.1 ; also sheet 1
GPIO25: R30.1 ; also sheet 1
GPIO27: R28.1 ; also sheet 1
N$2: D2.A R25.1
N$19: D1.A D2.C RELAY1.COIL-(L-) U8.3(COLLECTOR)
N$39: R24.2 U8.1(BASE)
N$40: D3.A D5.C RELAY2.COIL-(L-) U9.3(COLLECTOR)
N$41: D5.A R27.1
N$42: R26.2 U9.1(BASE)
N$43: D6.A D7.C RELAY3.COIL-(L-) U10.3(COLLECTOR)
N$44: D7.A R29.1
N$45: R28.2 U10.1(BASE)
N$46: D8.A D11.C RELAY4.COIL-(L-) U11.3(COLLECTOR)
N$47: D11.A R31.1
N$48: R30.2 U11.1(BASE)
SCADA_OUT1: RELAY3.OUT U$3.1
SCADA_OUT2: RELAY4.OUT U$3.3

### Notes on the sheet
- BMS relay first alarm
- BMS relay second alarm
- BMS outputs
- SCADA outputs
- SCADA relay second alarm
- SCADA relay first alarm

## Sheet 7 of 7: DAC & 4-20mA loop
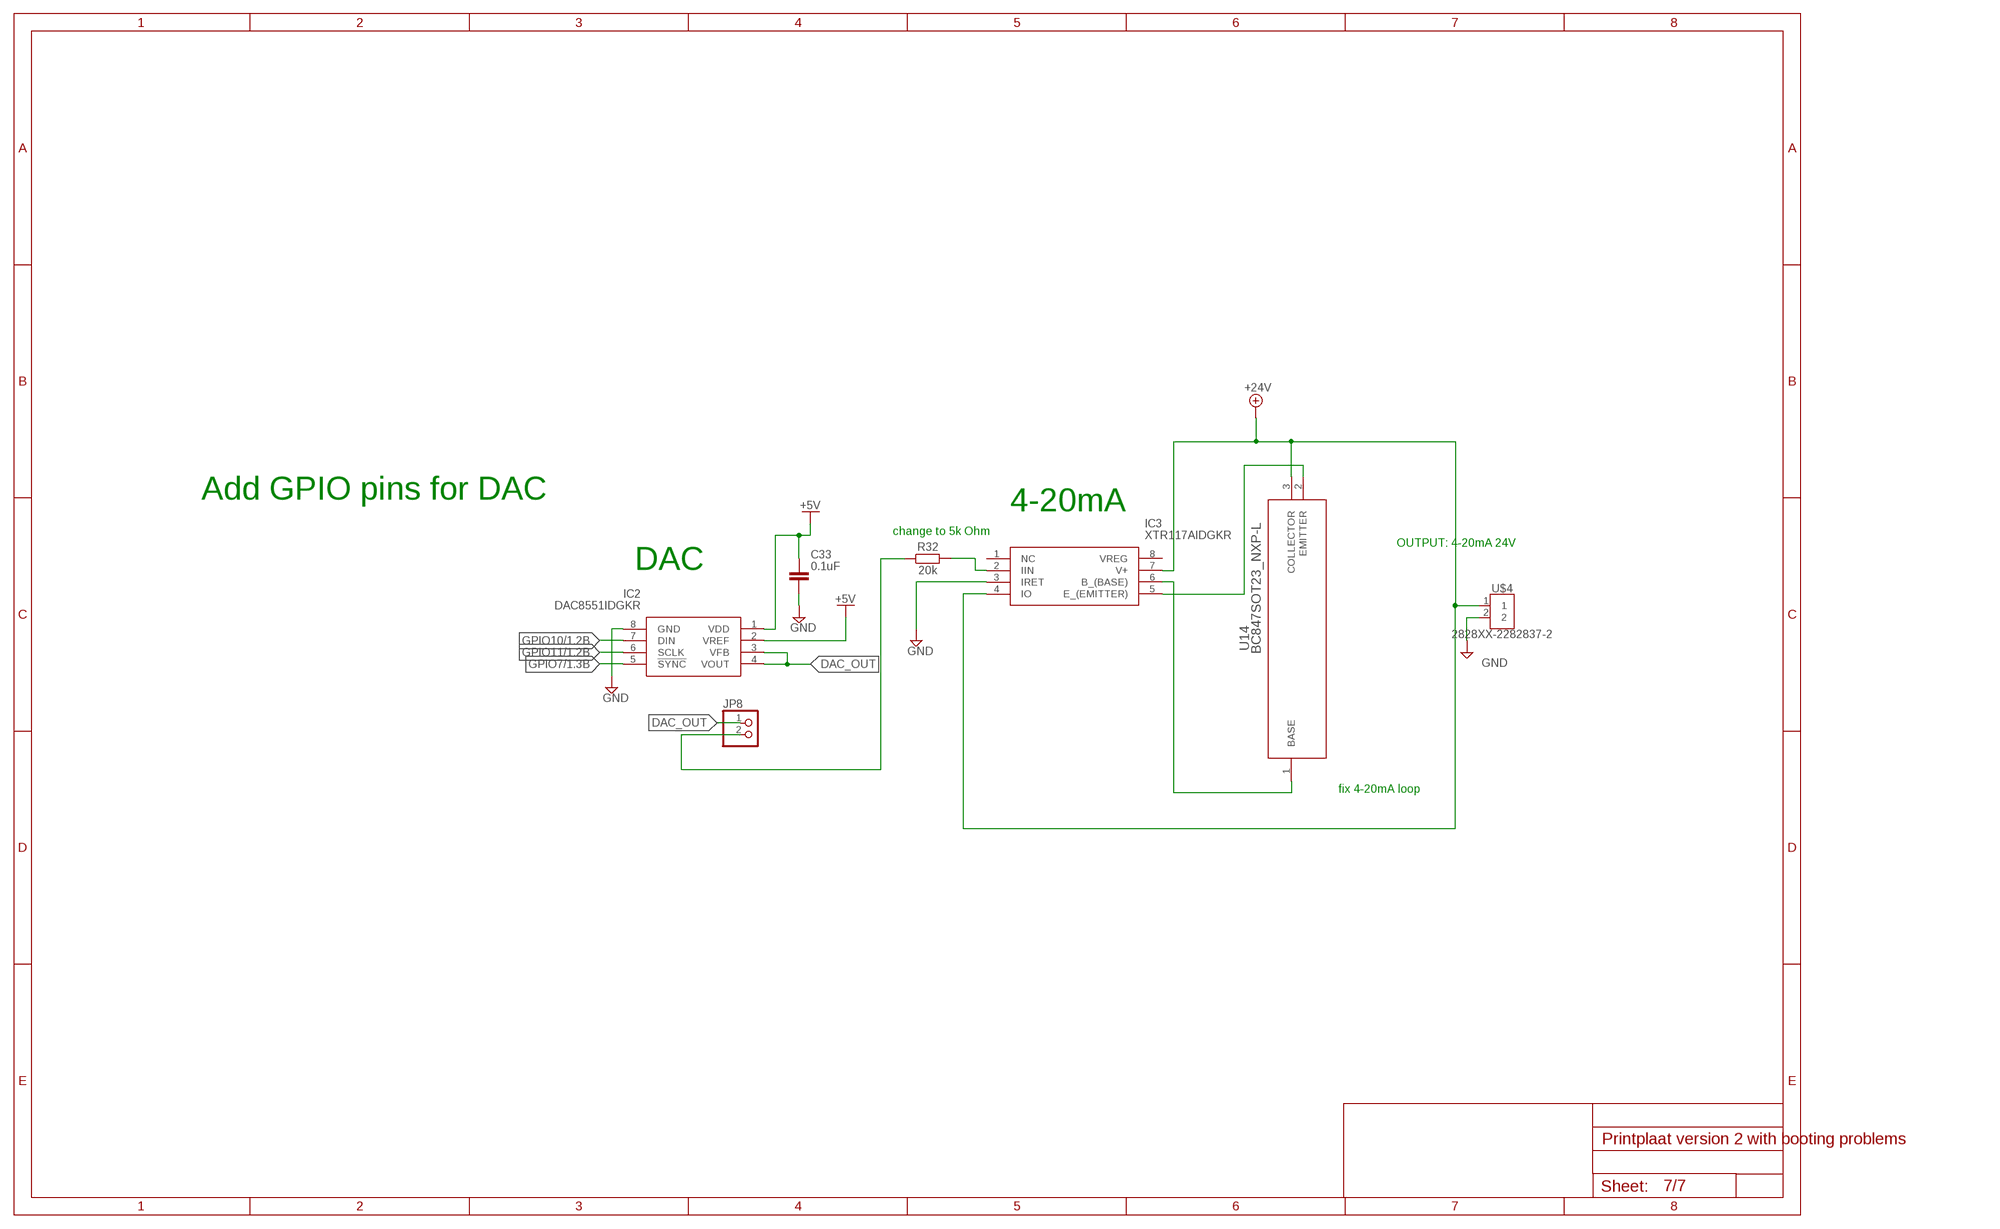
[diagram p6: schematic, sheet 7]

### Parts
C33  0.1uF  C_CHIP-1206(3216-METRIC)  [CAPC3216X135]
IC2  DAC8551IDGKR  [SOP65P490X110-8N]
IC3  XTR117AIDGKR  [SOP65P490X110-8N]
JP8  PINHD-1X2  [1X02]
R32  20k  RESISTOR__CHIP-1206(3216-METRIC)  [RESC3216X70]
U14  BC847SOT23_NXP-L  [SOT23_NXP-L]
U$4  2828XX-2282837-2  [TERMBLK_508-2N]

### Nets
+5V: C33.1 IC2.1(VDD) IC2.2(VREF) ; also sheet 1,2,3,4,5,6
+24V: IC3.4(IO) IC3.7(V+) U14.3(COLLECTOR) U$4.1 ; also sheet 4,5,6
DAC_OUT: IC2.3(VFB) IC2.4(VOUT) JP8.1
GND: C33.2 IC2.8(GND) IC3.3(IRET) U$4.2 ; also sheet 1,2,3,4,5,6
GPIO7: IC2.5(!SYNC) ; also sheet 1
GPIO10: IC2.7(DIN) ; also sheet 1,5
GPIO11: IC2.6(SCLK) ; also sheet 1,5
N$49: IC3.5(E_(EMITTER)) U14.2(EMITTER)
N$50: IC3.6(B_(BASE)) U14.1(BASE)
N$51: JP8.2 R32.1
N$52: IC3.2(IIN) R32.2
Unconnected: IC3.1(NC) IC3.8(VREG)

### Notes on the sheet
- Add GPIO pins for DAC
- 4-20mA
- change to 5k Ohm
- OUTPUT: 4-20mA 24V
- DAC
- fix 4-20mA loop

## Power pins joined to a net without a drawn wire
GND_8: U5.8(GND_8)

## Library data of the parts
C1-C14 C16 C18 C20 C21 C24-C27 C37-C40 = Tinkercad:CAPACITOR: Capacitor - Generic; CATEGORY: Capacitor
C15 = 20TDC100MYF:20TDC100MYF: Check availability <https://pricing.snapeda.com/parts/20TDC100MYF/Panasonic%20Electronic%20Components/view-part?ref=eda>; AVAILABILITY: In Stock; CHECK_PRICES: https://www.snapeda.com/parts/20TDC100MYF/Panasonic/view-part/?ref=eda; DESCRIPTION: Cap Tant Polymer 100uF 20VDC D3L CASE 20% (7.3 X 4.3 X 2.8mm) SMD 0.055 Ohm 125°C T/R; MF: Panasonic Electronic Components; MP: 20TDC100MYF; PACKAGE: 7343-2 Panasonic; PRICE: None; PURCHASE-URL: https://www.snapeda.com/api/url_track_click_mouser/?unipart_id=4927236&manufacturer=Panasonic Electronic Components&part_name=20TDC100MYF&search_term=None; SNAPEDA_LINK: https://www.snapeda.com/parts/20TDC100MYF/Panasonic/view-part/?ref=snap
C17 C23 C32 = EEEFC1H2R2R:EEEFC1H2R2R: Panasonic 2.2uF 50V dc Aluminium Electrolytic Capacitor, Surface Mount 4 (Dia.) x 5.4mm +105C 4mm Source: Datasheet <http://industrial.panasonic.com/cdbs/www-data/pdf/RDE0000/ABA0000C1172.pdf>; DESCRIPTION: Panasonic 2.2uF 50V dc Aluminium Electrolytic Capacitor, Surface Mount 4 (Dia.) x 5.4mm +105C 4mm; HEIGHT: 5.5mm; MANUFACTURER_NAME: Panasonic; MANUFACTURER_PART_NUMBER: EEEFC1H2R2R
C19 = GRM32EC81C476KE15L:GRM32EC81C476KE15L: SMD Capacitor X6S(EIA) with Capacitance: 47uF Tol. 10%. Rated Voltage: 16Vdc Check availability <https://pricing.snapeda.com/parts/GRM32EC81C476KE15L/Murata%20Electronics/view-part?ref=eda>; AVAILABILITY: In Stock; CHECK_PRICES: https://www.snapeda.com/parts/GRM32EC81C476KE15L/Murata/view-part/?ref=eda; DESCRIPTION: 47 µF ±10% 16V Ceramic Capacitor X6S 1210 (3225 Metric); MF: Murata Electronics; MP: GRM32EC81C476KE15L; PACKAGE: 3225 Murata; PRICE: None; SNAPEDA_LINK: https://www.snapeda.com/parts/GRM32EC81C476KE15L/Murata/view-part/?ref=snap
C22 = CGA4C2C0G1H472J060AA:CGA4C2C0G1H472J060AA: Multilayer Ceramic Chip Capacitors, Capacitance=4.7nF, LxWxT:2x1.25x0.6mm Source: Datasheet; DESCRIPTION: Multilayer Ceramic Chip Capacitors, Capacitance=4.7nF, LxWxT:2x1.25x0.6mm; HEIGHT: 0.75mm; MANUFACTURER_NAME: TDK; MANUFACTURER_PART_NUMBER: CGA4C2C0G1H472J060AA; MOUSER_PART_NUMBER: 810-CGA4C2C0G1H472J; MOUSER_PRICE-STOCK: https://www.mouser.co.uk/ProductDetail/TDK/CGA4C2C0G1H472J060AA?qs=FxQuwy19cyCgdYzJw5%252BHfA%3D%3D
C28 C41 = EMK107B7105KA-T:EMK107B7105KA-T: Ceramic Capacitor 0603 16V 1uF Source: Datasheet <https://componentsearchengine.com/Datasheets/1/EMK107B7105KA-T.pdf>; DESCRIPTION: Ceramic Capacitor 0603 16V 1uF; HEIGHT: 0.9mm; MANUFACTURER_NAME: TAIYO YUDEN; MANUFACTURER_PART_NUMBER: EMK107B7105KA-T; MOUSER_PART_NUMBER: 963-EMK107B7105KA-T; MOUSER_PRICE-STOCK: https://www.mouser.co.uk/ProductDetail/TAIYO-YUDEN/EMK107B7105KA-T?qs=I6KAKw0tg2zS1zj87Lm%2FxQ%3D%3D
C29 C42 = C3216X5R1H106K160AB:C3216X5R1H106K160AB: 1206 X5R ceramic capacitor 10uF 50V TDK 1206 C 10F Ceramic Multilayer Capacitor, 50 V dc X5R Dielectric +/-10% SMD Source: Datasheet <https://product.tdk.com/info/en/catalog/datasheets/mlcc_commercial_midvoltage_en.pdf>; DESCRIPTION: 1206 X5R ceramic capacitor 10uF 50V TDK 1206 C 10F Ceramic Multilayer Capacitor, 50 V dc X5R Dielectric +/-10% SMD; HEIGHT: 1.8mm; MANUFACTURER_NAME: TDK; MANUFACTURER_PART_NUMBER: C3216X5R1H106K160AB; MOUSER_PART_NUMBER: 810-C3216X5R1H106K; MOUSER_PRICE-STOCK: https://www.mouser.co.uk/ProductDetail/TDK/C3216X5R1H106K160AB?qs=NRhsANhppD%252BLHMbxvQzsEQ%3D%3D
C30 C43 = CGA3E2X7R1H104K080AA:CGA3E2X7R1H104K080AA: Multilayer Ceramic Chip Capacitors, Capacitance=0.1uF, LxWxT:1.6x0.8x0.8mm Source: Datasheet; DESCRIPTION: Multilayer Ceramic Chip Capacitors, Capacitance=0.1uF, LxWxT:1.6x0.8x0.8mm; HEIGHT: 0.9mm; MANUFACTURER_NAME: TDK; MANUFACTURER_PART_NUMBER: CGA3E2X7R1H104K080AA; MOUSER_PART_NUMBER: 810-CGA3E2X7R1H104K; MOUSER_PRICE-STOCK: https://www.mouser.co.uk/ProductDetail/TDK/CGA3E2X7R1H104K080AA?qs=NRhsANhppD%2Fge2a869G9Fg%3D%3D
C31 C33-C36 = Capacitor:C: Capacitor - Generic; CATEGORY: Capacitor
CR1 = 2024-04-09_15-45-34_Library:SMBJ54A; COPYRIGHT: Copyright (C) 2024 Ultra Librarian. All rights reserved.; MANUFACTURER_PART_NUMBER: SMBJ54A; MFR_NAME: Littelfuse Inc
CR2 = B220-13-F:B220A-13-F; COPYRIGHT: Copyright (C) 2024 Ultra Librarian. All rights reserved.; MANUFACTURER_PART_NUMBER: B220A-13-F; MFR_NAME: Diodes Inc
D1 D3 D6 D8 = Diodes:1N4148WS: DIODE GEN PURP 75V 150MA SOD323F Manufacturer's datasheet <https://www.onsemi.com/pub/Collateral/1N914BWS-D.pdf>; CREATED_BY: PCBLayout.com; DIGIKEY_PART_NUMBER: 1N4148WSFSTR-ND; MANUFACTURER: Diodes Incorporated; MPN: 1N4148WS; PACKAGE: SOD-323
D2 D4 D5 D7 D11 = LED:CHIP-FLAT-R; CATEGORY: LED; COLOR: RED; DESCRIPTION: CHIP LED FLAT; SUB-CATEGORY: CHIP; TYPE: FLAT_TOP
D9 = STPS30M60SG-TR:STPS30M60SG-TR: STMicroelectronics STPS30M60SG-TR, SMT Schottky Diode, 60V 30A, 3-Pin D2PAK Source: Datasheet <https://componentsearchengine.com/Datasheets/1/STPS30M60SG-TR.pdf>; DESCRIPTION: STMicroelectronics STPS30M60SG-TR, SMT Schottky Diode, 60V 30A, 3-Pin D2PAK; HEIGHT: 4mm; MANUFACTURER_NAME: STMicroelectronics; MANUFACTURER_PART_NUMBER: STPS30M60SG-TR; MOUSER_PART_NUMBER: 511-STPS30M60SG-TR; MOUSER_PRICE-STOCK: https://www.mouser.co.uk/ProductDetail/STMicroelectronics/STPS30M60SG-TR?qs=G49gCGQm93g67AcseEWC2A%3D%3D
D10 = B240A-13-F:B240A-13-F: Schottky Diode 2A 40V 0.5Vf SMA Diodes Inc B240A-13-F, SMT Schottky Diode, 40V 2A, 2-Pin DO-214AC Source: Datasheet <https://datasheet.datasheetarchive.com/originals/distributors/SFDatasheet-0/sf-0003166.pdf>; DESCRIPTION: Schottky Diode 2A 40V 0.5Vf SMA Diodes Inc B240A-13-F, SMT Schottky Diode, 40V 2A, 2-Pin DO-214AC; HEIGHT: 2.3mm; MANUFACTURER_NAME: Diodes Incorporated; MANUFACTURER_PART_NUMBER: B240A-13-F; MOUSER_PART_NUMBER: 621-B240A-F; MOUSER_PRICE-STOCK: https://www.mouser.co.uk/ProductDetail/Diodes-Incorporated/B240A-13-F?qs=idJYQZufS6jleWUCPMvVdQ%3D%3D
FU1 = Wurth_Connectors_WR-FSH:696103201002: WR-FSH Fuseholder THR Blocks PCB Clip Cover MATERIAL PROPERTIES Insulator Material PETG35 Insulator Flammability Rating UL94 V-0 Insulator Color Black Contact Material Copper Alloy Contact Plating Tin over Nickel Contact Type Stamped GENERAL INFORMATION Operating Temperature -30 up to +120 °C Compliance RoHS ELECTRICAL PROPERTIES IR UL 20 A IR VDE 10 A Working Voltage [UL] 250 V (AC) Working Voltage [VDE] 250 V (AC) Withstanding Voltage [UL] 1500 V (AC) Withstanding Voltage [VDE] 1500 V (AC) Contact Resistance 10 mΩ Contact Resistance [VDE] 10 mΩ MECHANICAL PROPERTIES Protection Class I & II Fuse Size 5x20 mm CERTIFICATION cULus Approval E157417 VDE Approval 120170 PACKAGING PROPERTIES Packaging Box <https://katalog.we-online.com/media/images/v2/o58927v209%20Family_p748_WR-FUSE_6961032010xx_4C.jpg> Details see: https://katalog.we-online.com/en/em/FSH_THR_PCB_CLIP_COVER_696103201002 Updated by Ella Wu 2019-10-25 2019 (C) Wurth Elektronik; DATASHEET-URL: https://www.we-online.com/catalog/datasheet/696103201002.pdf; IR-UL: 20A; IR-VDE: 10A; PART-NUMBER: 696103201002
H1-H4 = holes:MOUNT-PAD-ROUND: MOUNTING PAD, round
IC1 IC4 = LM5157QRTERQ1:LM5157QRTERQ1: Switching Voltage Regulators 6-A, 50-V, 2.2-MHz wide VIN boost, flyback, & SEPIC converter with dual random spread spectrum Source: Datasheet <https://pdf1.alldatasheet.com/datasheet-pdf/view/1264204/TI/LM5157QRTERQ1.html>; DESCRIPTION: Switching Voltage Regulators 6-A, 50-V, 2.2-MHz wide VIN boost, flyback, & SEPIC converter with dual random spread spectrum; HEIGHT: 0.8mm; MANUFACTURER_NAME: Texas Instruments; MANUFACTURER_PART_NUMBER: LM5157QRTERQ1; MOUSER_PART_NUMBER: 595-LM5157QRTERQ1; MOUSER_PRICE-STOCK: https://www.mouser.co.uk/ProductDetail/Texas-Instruments/LM5157QRTERQ1?qs=QNEnbhJQKvb8%252BoI1%252BJEaeg%3D%3D
IC2 = DAC8551IDGKR:DAC8551IDGKR: 16-Bit, Ultralow Glitch, Voltage Output, Digital to Analog Converter Source: Datasheet <http://www.ti.com/lit/gpn/DAC8551>; DESCRIPTION: 16-Bit, Ultralow Glitch, Voltage Output, Digital to Analog Converter; HEIGHT: 1.1mm; MANUFACTURER_NAME: Texas Instruments; MANUFACTURER_PART_NUMBER: DAC8551IDGKR; MOUSER_PART_NUMBER: 595-DAC8551IDGKR; MOUSER_PRICE-STOCK: https://www.mouser.co.uk/ProductDetail/Texas-Instruments/DAC8551IDGKR?qs=vul0MlC%2Fa1dStr8sTUNGkA%3D%3D
IC3 = XTR117AIDGKR:XTR117AIDGKR: Sensor Interface XTR117 4-20mA Crnt Loop Transmitter Source: Datasheet <http://www.ti.com/lit/ds/symlink/xtr117.pdf>; DESCRIPTION: Sensor Interface XTR117 4-20mA Crnt Loop Transmitter; HEIGHT: 1.1mm; MANUFACTURER_NAME: Texas Instruments; MANUFACTURER_PART_NUMBER: XTR117AIDGKR; MOUSER_PART_NUMBER: 595-XTR117AIDGKR; MOUSER_PRICE-STOCK: https://www.mouser.co.uk/ProductDetail/Texas-Instruments/XTR117AIDGKR?qs=zqbRmZ%252BfZD%252BYMdmF%252BmhQwg%3D%3D
J1 J4 = DF40C-100DS-0.4V_51_:DF40C-100DS-0.4V(51): Check availability <https://pricing.snapeda.com/parts/DF40C-100DS-0.4V%2851%29/Hirose/view-part?ref=eda>; AVAILABILITY: In Stock; CHECK_PRICES: https://www.snapeda.com/parts/DF40C-100DS-0.4V(51)/Hirose/view-part/?ref=eda; DESCRIPTION: 100 Position Connector Receptacle, Center Strip Contacts Surface Mount Gold; MF: Hirose; MP: DF40C-100DS-0.4V(51); PACKAGE: None; PRICE: None; SNAPEDA_LINK: https://www.snapeda.com/parts/DF40C-100DS-0.4V(51)/Hirose/view-part/?ref=snap
J2 = ZX62D-B-5P8:ZX62D-B-5P8: SMD+DIP Micro USB; MICRO-B-SMD Check availability <https://pricing.snapeda.com/parts/ZX62D-B-5P8/Hirose/view-part?ref=eda>; AVAILABILITY: In Stock; CHECK_PRICES: https://www.snapeda.com/parts/ZX62D-B-5P8/Hirose+Electric+Co+Ltd/view-part/?ref=eda; DESCRIPTION: USB - micro B USB 2.0 Receptacle Connector 5 Position Surface Mount, Right Angle; Through Hole; MF: Hirose; MP: ZX62D-B-5P8; PACKAGE: None; PRICE: None; PURCHASE-URL: https://www.snapeda.com/api/url_track_click_mouser/?unipart_id=110243&manufacturer=Hirose&part_name=ZX62D-B-5P8&search_term=None; SNAPEDA_LINK: https://www.snapeda.com/parts/ZX62D-B-5P8/Hirose+Electric+Co+Ltd/view-part/?ref=snap
J3 = USB1035-XX-X-X-X-B_REVE:USB1035-XX-X-X-X-B_REVE: USB DUAL RECEPTACLE, TYPE A, 8 PIN, THROUGH HOLE, HORIZONTAL, TOP MOUNTt, WITH KINKED SHELL STAKES Check availability <https://pricing.snapeda.com/parts/USB1035-GF-P-0-B-B/Global%20Connector%20Technology/view-part?ref=eda>; AVAILABILITY: Not in stock; CHECK_PRICES: https://www.snapeda.com/parts/USB1035-GF-P-0-B-B/Global+Connector+Technology/view-part/?ref=eda; DESCRIPTION: USB-A (USB TYPE-A), Stacked USB 2.0 Receptacle Connector 8 Position Through Hole, Right Angle; MF: Global Connector Technology; MP: USB1035-GF-P-0-B-B; PACKAGE: None; PRICE: None; PURCHASE-URL: https://www.snapeda.com/api/url_track_click_mouser/?unipart_id=812865&manufacturer=Global Connector Technology&part_name=USB1035-GF-P-0-B-B&search_term=None; SNAPEDA_LINK: https://www.snapeda.com/parts/USB1035-GF-P-0-B-B/Global+Connector+Technology/view-part/?ref=snap
J5 = PCIE-036-02-X-D-RA:PCIE-036-02-X-D-RA: 1.00 mm PCI Express® Edge Card Connector Check availability <https://pricing.snapeda.com/parts/PCIE-036-02-F-D-RA/Samtec/view-part?ref=eda>; AVAILABILITY: In Stock; CHECK_PRICES: https://www.snapeda.com/parts/PCIE-036-02-F-D-RA/Samtec+Inc./view-part/?ref=eda; DESCRIPTION: 36 Position Female Connector PCI Express™ Gold 0.039 (1.00mm) Black; MF: Samtec; MP: PCIE-036-02-F-D-RA; PACKAGE: None; PRICE: None; SNAPEDA_LINK: https://www.snapeda.com/parts/PCIE-036-02-F-D-RA/Samtec+Inc./view-part/?ref=snap
J6 = Connector:2828XX-4: 4 Position Wire to Board Terminal Block Horizontal with Board Datasheet <https://www.te.com.cn/commerce/DocumentDelivery/DDEController?Action=showdoc&DocId=Catalog+Section%7F1308389_EUROSTYLE_TERMINAL_BLOCKS%7F0607%7Fpdf%7FEnglish%7FENG_CS_1308389_EUROSTYLE_TERMINAL_BLOCKS_0607.pdf%7F2-282837-5>; CATEGORY: Fixed Terminal Blocks; DATASHEET: https://www.te.com/usa-en/product-282837-4.datasheet.pdf; DESCRIPTION: 4 Position Wire to Board Terminal Block Horizontal with Board 0.200" (5.08mm) Through Hole; MANUFACTURER: TE Connectivity AMP Connectors; MPN: 282837-4; OPERATING_TEMPERATURE: -40°C ~ 105°C; PACKAGE_SIZE: NA; PACKAGE_TYPE: THT; PART_STATUS: ACTIVE; PITCH: 0.200" (5.08mm); ROHS: COMPLIANT; SERIES: Buchanan; SUBCATEGORY: Terminal Blocks; TYPE: Through Hole Screw - Rising Cage Clamp Side wire entry Horizontal with Board
J7 = 1-1734248-5:1-1734248-5: TE CONNECTIVITY - 1-1734248-5 - CONNECTOR, FFC/FPC, 15POS, 1MM Source: Datasheet <https://www.te.com/commerce/DocumentDelivery/DDEController?Action=showdoc&DocId=Customer Drawing1734248E1pdfEnglishENG_CD_1734248_E1__.pdf1-1734248-5>; DESCRIPTION: TE CONNECTIVITY - 1-1734248-5 - CONNECTOR, FFC/FPC, 15POS, 1MM; HEIGHT: 7.7mm; MANUFACTURER_NAME: TE Connectivity; MANUFACTURER_PART_NUMBER: 1-1734248-5; MOUSER_PART_NUMBER: 571-1-1734248-5; MOUSER_PRICE-STOCK: https://www.mouser.co.uk/ProductDetail/TE-Connectivity/1-1734248-5?qs=GQ3BsEl46pkrMd7Fg9TUQQ%3D%3D
JP2 = Connector:PINHD-2X2: PIN HEADER; CATEGORY: CONNECTOR; SUB-CATEGORY: PIN-HEADER
JP3 = Connector:PINHD-2X5: PIN HEADER; CATEGORY: CONNECTOR; SUB-CATEGORY: PIN-HEADER
JP4 JP8 = pinhead:PINHD-1X2: PIN HEADER
JP6 = pinhead:PINHD-2X7: PIN HEADER
JP10 JP11 = pinhead:PINHD-1X3: PIN HEADER
L1 = XAL6060-103MEB:XAL6060-103MEB: Fixed Inductors XAL6060 High Current 10 uH 20% 7 A Compos Source: Datasheet; DESCRIPTION: Fixed Inductors XAL6060 High Current 10 uH 20% 7 A Compos; HEIGHT: mm; MANUFACTURER_NAME: COILCRAFT; MANUFACTURER_PART_NUMBER: XAL6060-103MEB; MOUSER_PART_NUMBER: 994-XAL6060-103MEB; MOUSER_PRICE-STOCK: https://www.mouser.co.uk/ProductDetail/Coilcraft/XAL6060-103MEB?qs=VJjuEbE9QBODk8cxO8T25A%3D%3D
L2 = SDR1307-270ML:SDR1307-270ML: Fixed Inductors 27uH 20% SMD 1307 Source: Datasheet <https://www.bourns.com/pdfs/SDR1307.pdf>; DESCRIPTION: Fixed Inductors 27uH 20% SMD 1307; HEIGHT: 7.3mm; MANUFACTURER_NAME: Bourns; MANUFACTURER_PART_NUMBER: SDR1307-270ML; MOUSER_PART_NUMBER: 652-SDR1307-270ML; MOUSER_PRICE-STOCK: https://www.mouser.co.uk/ProductDetail/Bourns/SDR1307-270ML?qs=96C2vqMyhurCDUZOgzNoEQ%3D%3D
L3 = SRN8040-1R5Y:SRN8040-1R5Y: Bourns SRN8040 Series Type 8040 Shielded Wire-wound SMD Inductor with a Ferrite Core, 1.5 uH +/-30% Wire-Wound 8.2A Idc Source: Datasheet <https://www.bourns.com/pdfs/SRN8040.pdf>; DESCRIPTION: Bourns SRN8040 Series Type 8040 Shielded Wire-wound SMD Inductor with a Ferrite Core, 1.5 uH +/-30% Wire-Wound 8.2A Idc; HEIGHT: 4mm; MANUFACTURER_NAME: Bourns; MANUFACTURER_PART_NUMBER: SRN8040-1R5Y; MOUSER_PART_NUMBER: 652-SRN8040-1R5Y; MOUSER_PRICE-STOCK: https://www.mouser.co.uk/ProductDetail/Bourns/SRN8040-1R5Y?qs=opBjA1TV902cPt4y6n%252BP5w%3D%3D
R1-R46 = Tinkercad:RESISTOR: Resistor Fixed - Generic; CATEGORY: Resistor; SUB-CATEGORY: Fixed
RELAY1-RELAY4 = Zettler AZ9371-1A-5D:ZETTLER_5V_RELAY
TP1-TP4 = testpad:TP: Test pad
U1 U2 = 74LVC1G07SE-7:74LVC1G07SE-7: Buffers & Line Drivers Single Gate Open Out 1.65 to 5.5V 32mA Source: Datasheet <https://www.diodes.com//assets/Datasheets/74LVC1G07.pdf>; DESCRIPTION: Buffers & Line Drivers Single Gate Open Out 1.65 to 5.5V 32mA; HEIGHT: 1.1mm; MANUFACTURER_NAME: Diodes Incorporated; MANUFACTURER_PART_NUMBER: 74LVC1G07SE-7
U3 = USB2514B-I_M2:USB2514B-I/M2: None Check availability <https://pricing.snapeda.com/parts/USB2514B-I/M2/Microchip/view-part?ref=eda>; AVAILABILITY: In Stock; CHECK_PRICES: https://www.snapeda.com/parts/USB2514B-I/M2/Microchip/view-part/?ref=eda; DESCRIPTION: USB Hub Controller - USB Interface 36-SQFN (6x6); MF: Microchip; MP: USB2514B-I/M2; PACKAGE: VQFN-36 Microchip; PRICE: None; PURCHASE-URL: https://www.snapeda.com/api/url_track_click_mouser/?unipart_id=1237349&manufacturer=Microchip&part_name=USB2514B-I/M2&search_term=None; SNAPEDA_LINK: https://www.snapeda.com/parts/USB2514B-I/M2/Microchip/view-part/?ref=snap
U4 = FSUSB42MUX:FSUSB42MUX: Low Power, Two port, High speed, USB 2.0(480Mbps) UART switch MSOP-10 Check availability <https://pricing.snapeda.com/parts/FSUSB42MUX/onsemi/view-part?ref=eda>; AVAILABILITY: In Stock; CHECK_PRICES: https://www.snapeda.com/parts/FSUSB42MUX/Onsemi/view-part/?ref=eda; DESCRIPTION: Analog Switch Single DPDT 10-Pin MSOP T/R; MF: onsemi; MP: FSUSB42MUX; PACKAGE: MSOP-10 ON Semiconductor; PRICE: None; PURCHASE-URL: https://www.snapeda.com/api/url_track_click_mouser/?unipart_id=7100534&manufacturer=onsemi&part_name=FSUSB42MUX&search_term=None; SNAPEDA_LINK: https://www.snapeda.com/parts/FSUSB42MUX/Onsemi/view-part/?ref=snap
U5 = TPD4EUSB30DQAR:TPD4EUSB30DQAR: 4-channel ESD solution for SuperSpeed (6 Gbps) USB 3.0 interface 10-USON -40 to 85 Check availability <https://pricing.snapeda.com/parts/TPD4EUSB30DQAR/Texas%20Instruments/view-part?ref=eda>; AVAILABILITY: In Stock; CHECK_PRICES: https://www.snapeda.com/parts/TPD4EUSB30DQAR/Texas+Instruments/view-part/?ref=eda; DESCRIPTION: Quad 0.8-pF, 5.5-V, ±8-kV ESD protection diode with 5-A 8/20-uS surge rating for USB 3.0; MF: Texas Instruments; MP: TPD4EUSB30DQAR; PACKAGE: USON-10 Texas Instruments; PRICE: None; PURCHASE-URL: https://www.snapeda.com/api/url_track_click_mouser/?unipart_id=298999&manufacturer=Texas Instruments&part_name=TPD4EUSB30DQAR&search_term=None; SNAPEDA_LINK: https://www.snapeda.com/parts/TPD4EUSB30DQAR/Texas+Instruments/view-part/?ref=snap
U6 = AP22653W6-7:AP22653W6-7: Power Switch/Driver 1:1 P-Channel 2.1A SOT-23-6 Check availability <https://pricing.snapeda.com/parts/AP22653W6-7/Diodes%20Incorporated/view-part?ref=eda>; AVAILABILITY: In Stock; CHECK_PRICES: https://www.snapeda.com/parts/AP22653W6-7/Diodes+Inc./view-part/?ref=eda; DESCRIPTION: Power Switch/Driver 1:1 P-Channel 2.1A SOT-23-6; MF: Diodes Incorporated; MP: AP22653W6-7; PACKAGE: SOT-23-6 Diodes Incorporated; PRICE: None; PURCHASE-URL: https://www.snapeda.com/api/url_track_click_mouser/?unipart_id=4792807&manufacturer=Diodes Incorporated&part_name=AP22653W6-7&search_term=None; SNAPEDA_LINK: https://www.snapeda.com/parts/AP22653W6-7/Diodes+Inc./view-part/?ref=snap
U7 = 2024-10-11_09-28-41_Library:TPS54561QDPRRQ1; COPYRIGHT: Copyright (C) 2024 Ultra Librarian. All rights reserved.; MANUFACTURER_PART_NUMBER: TPS54561QDPRRQ1; MFR_NAME: Texas Instruments; REFDES: RefDes; TYPE: TYPE
U8-U11 U14 = 2024-10-31_10-28-23_Library:BC847; COPYRIGHT: Copyright (C) 2024 Ultra Librarian. All rights reserved.; MANUFACTURER_PART_NUMBER: BC847; MFR_NAME: NXP
U13 = SnapEDA Library:MCP3008-I/SL
U$1 U$3_SENSOR1 U$4 = Connector:2828XX-2: 2 Position Wire to Board Terminal Block Horizontal with Board Datasheet <https://www.te.com.cn/commerce/DocumentDelivery/DDEController?Action=showdoc&DocId=Catalog+Section%7F1308389_EUROSTYLE_TERMINAL_BLOCKS%7F0607%7Fpdf%7FEnglish%7FENG_CS_1308389_EUROSTYLE_TERMINAL_BLOCKS_0607.pdf%7F2-282837-5>; CATEGORY: Connector; DESCRIPTION: 2 Position Wire to Board Terminal Block Horizontal with Board 5.08 mm Through Hole; MANUFACTURER: TE Connectivity; MPN: 282837-2; OPERATING_TEMPERATURE: -40°C to +105°C; PART_STATUS: ACTIVE; ROHS_COMPLIANCE: RoHS Compliant; SERIES: 282837; SUBCATEGORY: Terminal Block; TYPE: Side Wire Entry
U$2 U$3 = Connector:2828XX-3: 3 Position Wire to Board Terminal Block Horizontal with Board Datasheet <https://www.te.com.cn/commerce/DocumentDelivery/DDEController?Action=showdoc&DocId=Catalog+Section%7F1308389_EUROSTYLE_TERMINAL_BLOCKS%7F0607%7Fpdf%7FEnglish%7FENG_CS_1308389_EUROSTYLE_TERMINAL_BLOCKS_0607.pdf%7F2-282837-5>; CATEGORY: Connector; DESCRIPTION: TERM BLK 3P SIDE ENT 5.08mm PCB; MANUFACTURER: TE Connectivity; MPN: 282837-3; OPERATING_TEMPERATURE: -40°C to +105°C; PART_STATUS: Active; ROHS_COMPLIANCE: RoHS Compliant; SERIES: 282837; SUBCATEGORY: Terminal Block; TYPE: Side Wire Entry
U$5 = Tinkercad:PINHD-1X05
Y1 = ABLS-24.000MHZ-B2-T:ABLS-24.000MHZ-B2-T: Source: Datasheet <https://abracon.com/Resonators/abls.pdf>; HEIGHT: mm; MANUFACTURER_NAME: ABRACON; MANUFACTURER_PART_NUMBER: ABLS-24.000MHZ-B2-T; MOUSER_PART_NUMBER: 815-ABLS-24-B2; MOUSER_PRICE-STOCK: https://www.mouser.co.uk/ProductDetail/ABRACON/ABLS-24000MHZ-B2-T/?qs=H8AWquzS%2FlNcDpKAPBucAQ%3D%3D